# EasyEDA Pro project Ruri-Passport-RevA.epro

# Schematic Mainboard

## Sheets
1 Audio_Storage: Assembly Variant: Basic; Board Name: Board1; Create Date: 2026-09-26; Page Name: Audio_Storage; Project Name: Ruri-Passport-RevA; Schematic Name: Mainboard; Update Date: 2026-09-26; Company: 嘉立创EDA; Page Size: Custom; Version: V1.0
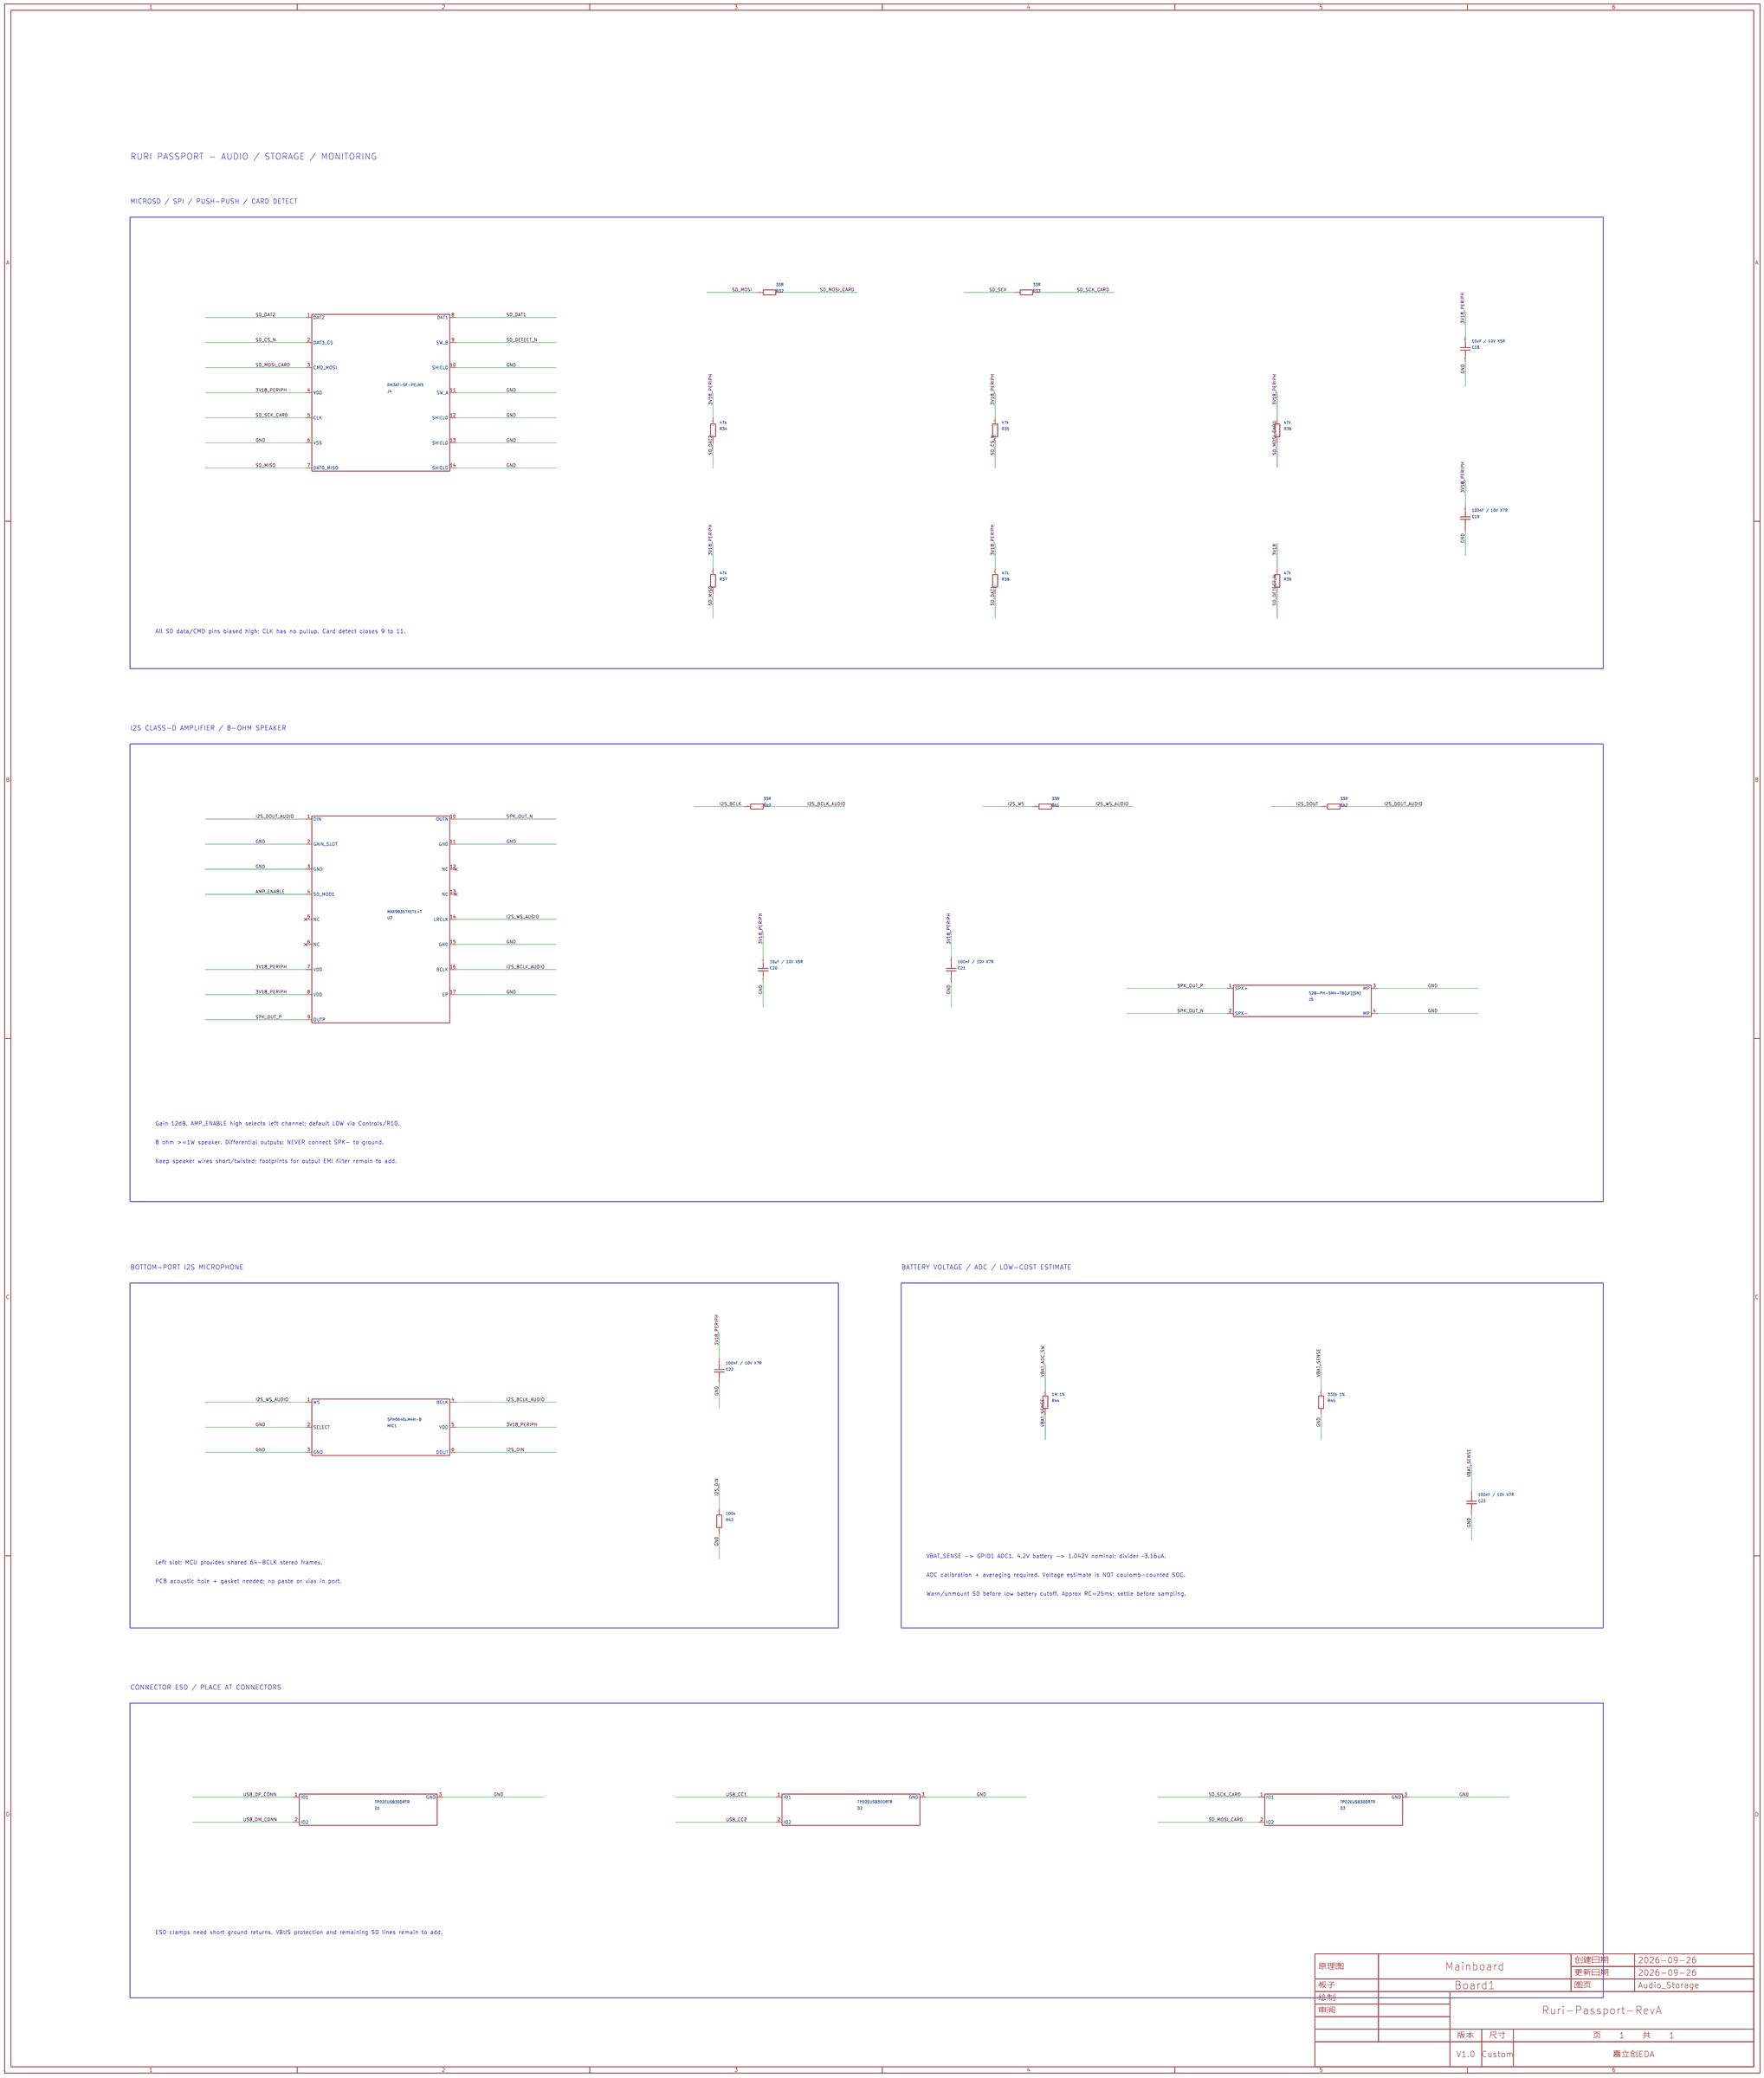
[diagram p0: Audio_Storage]
2 Core
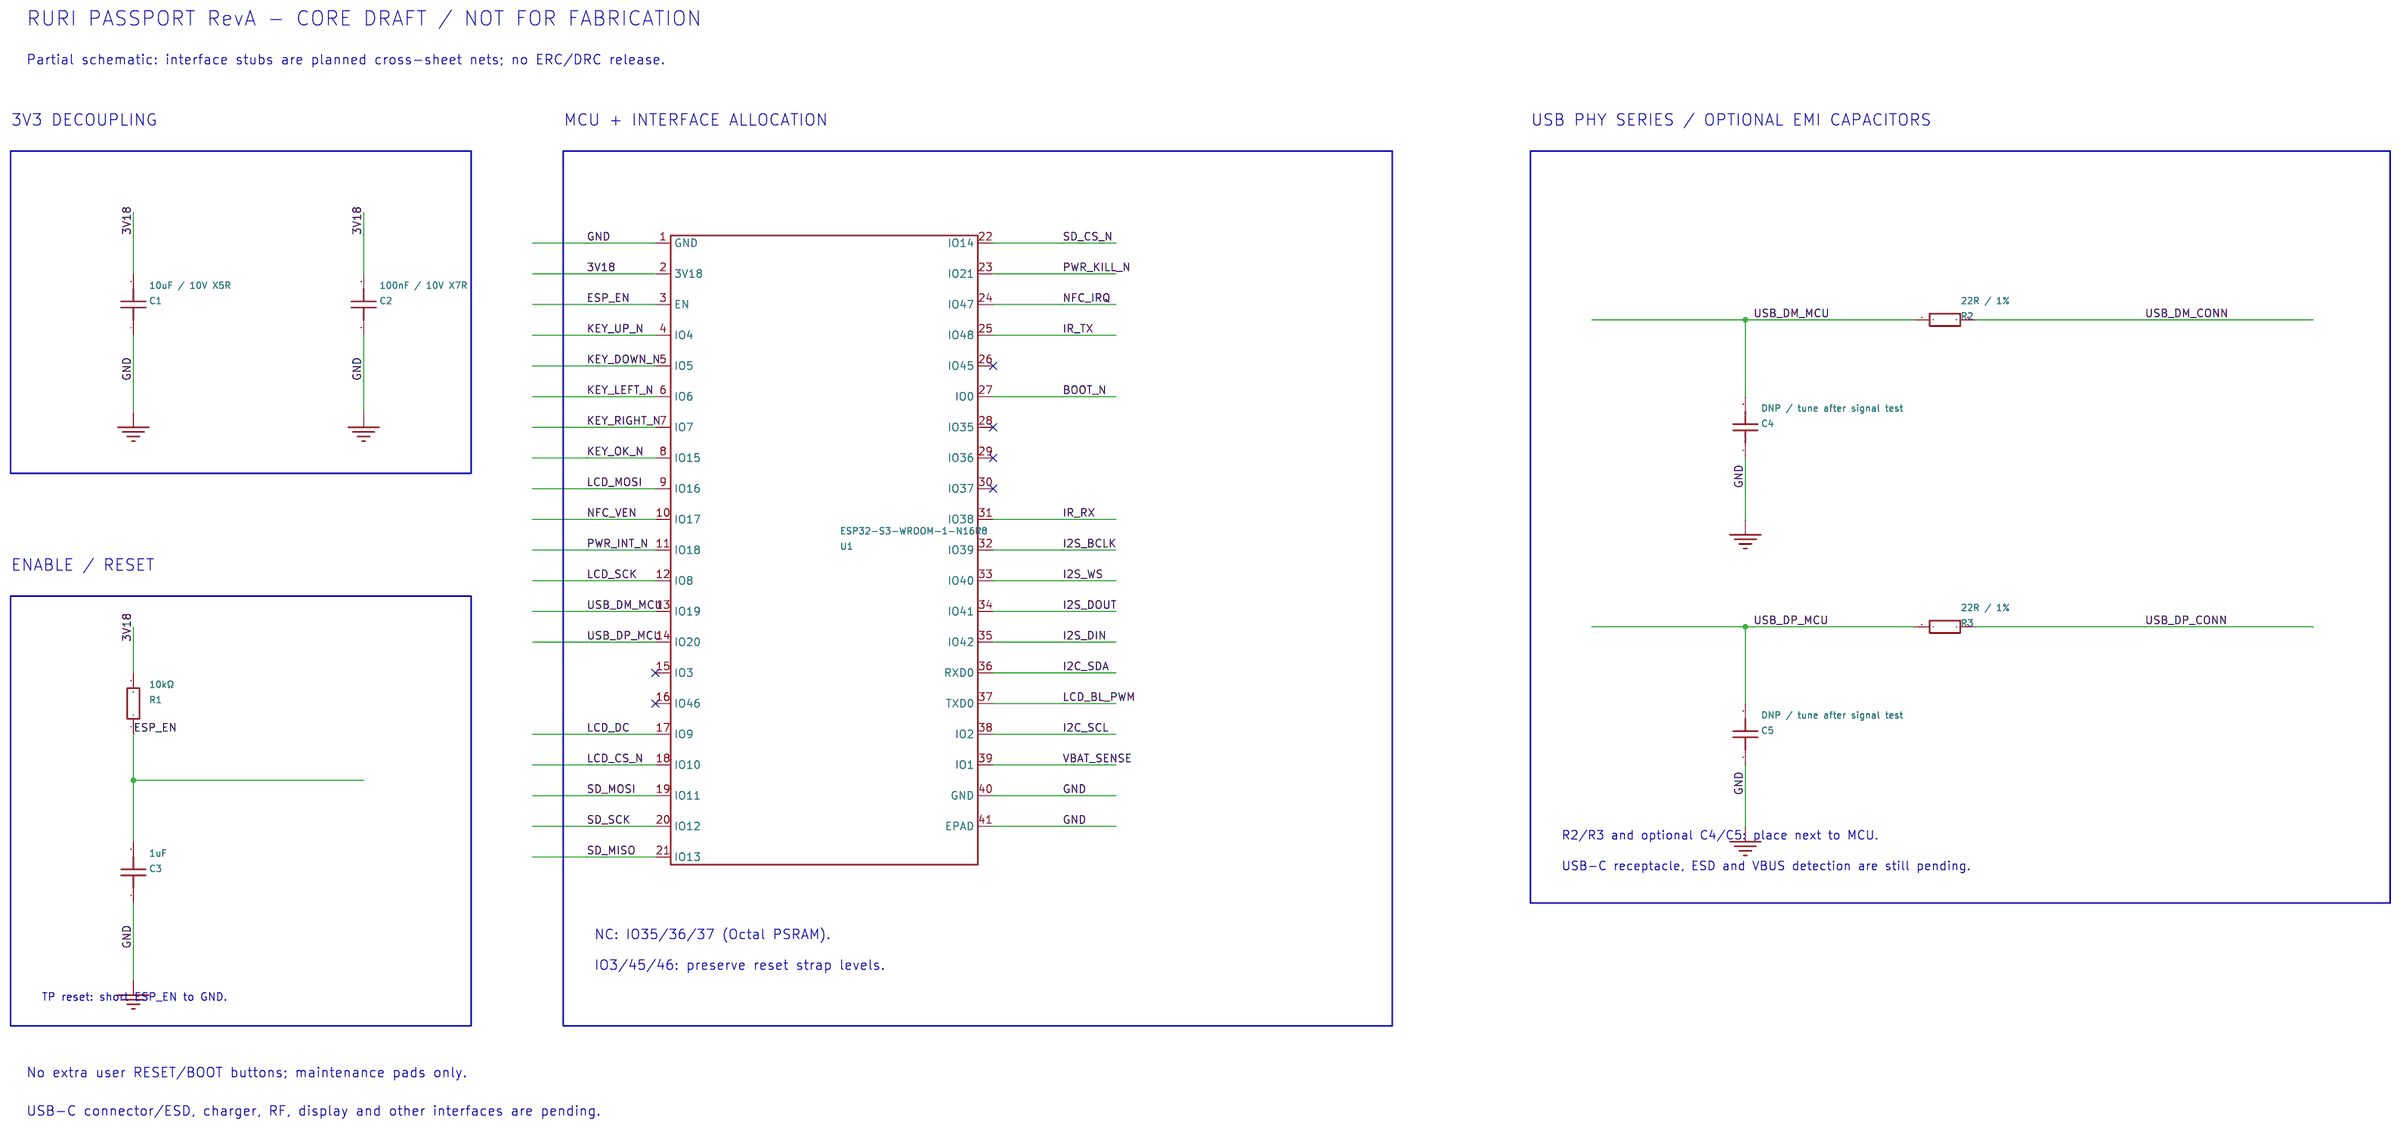
[diagram p1: Core]
3 Display: Page Name: Display
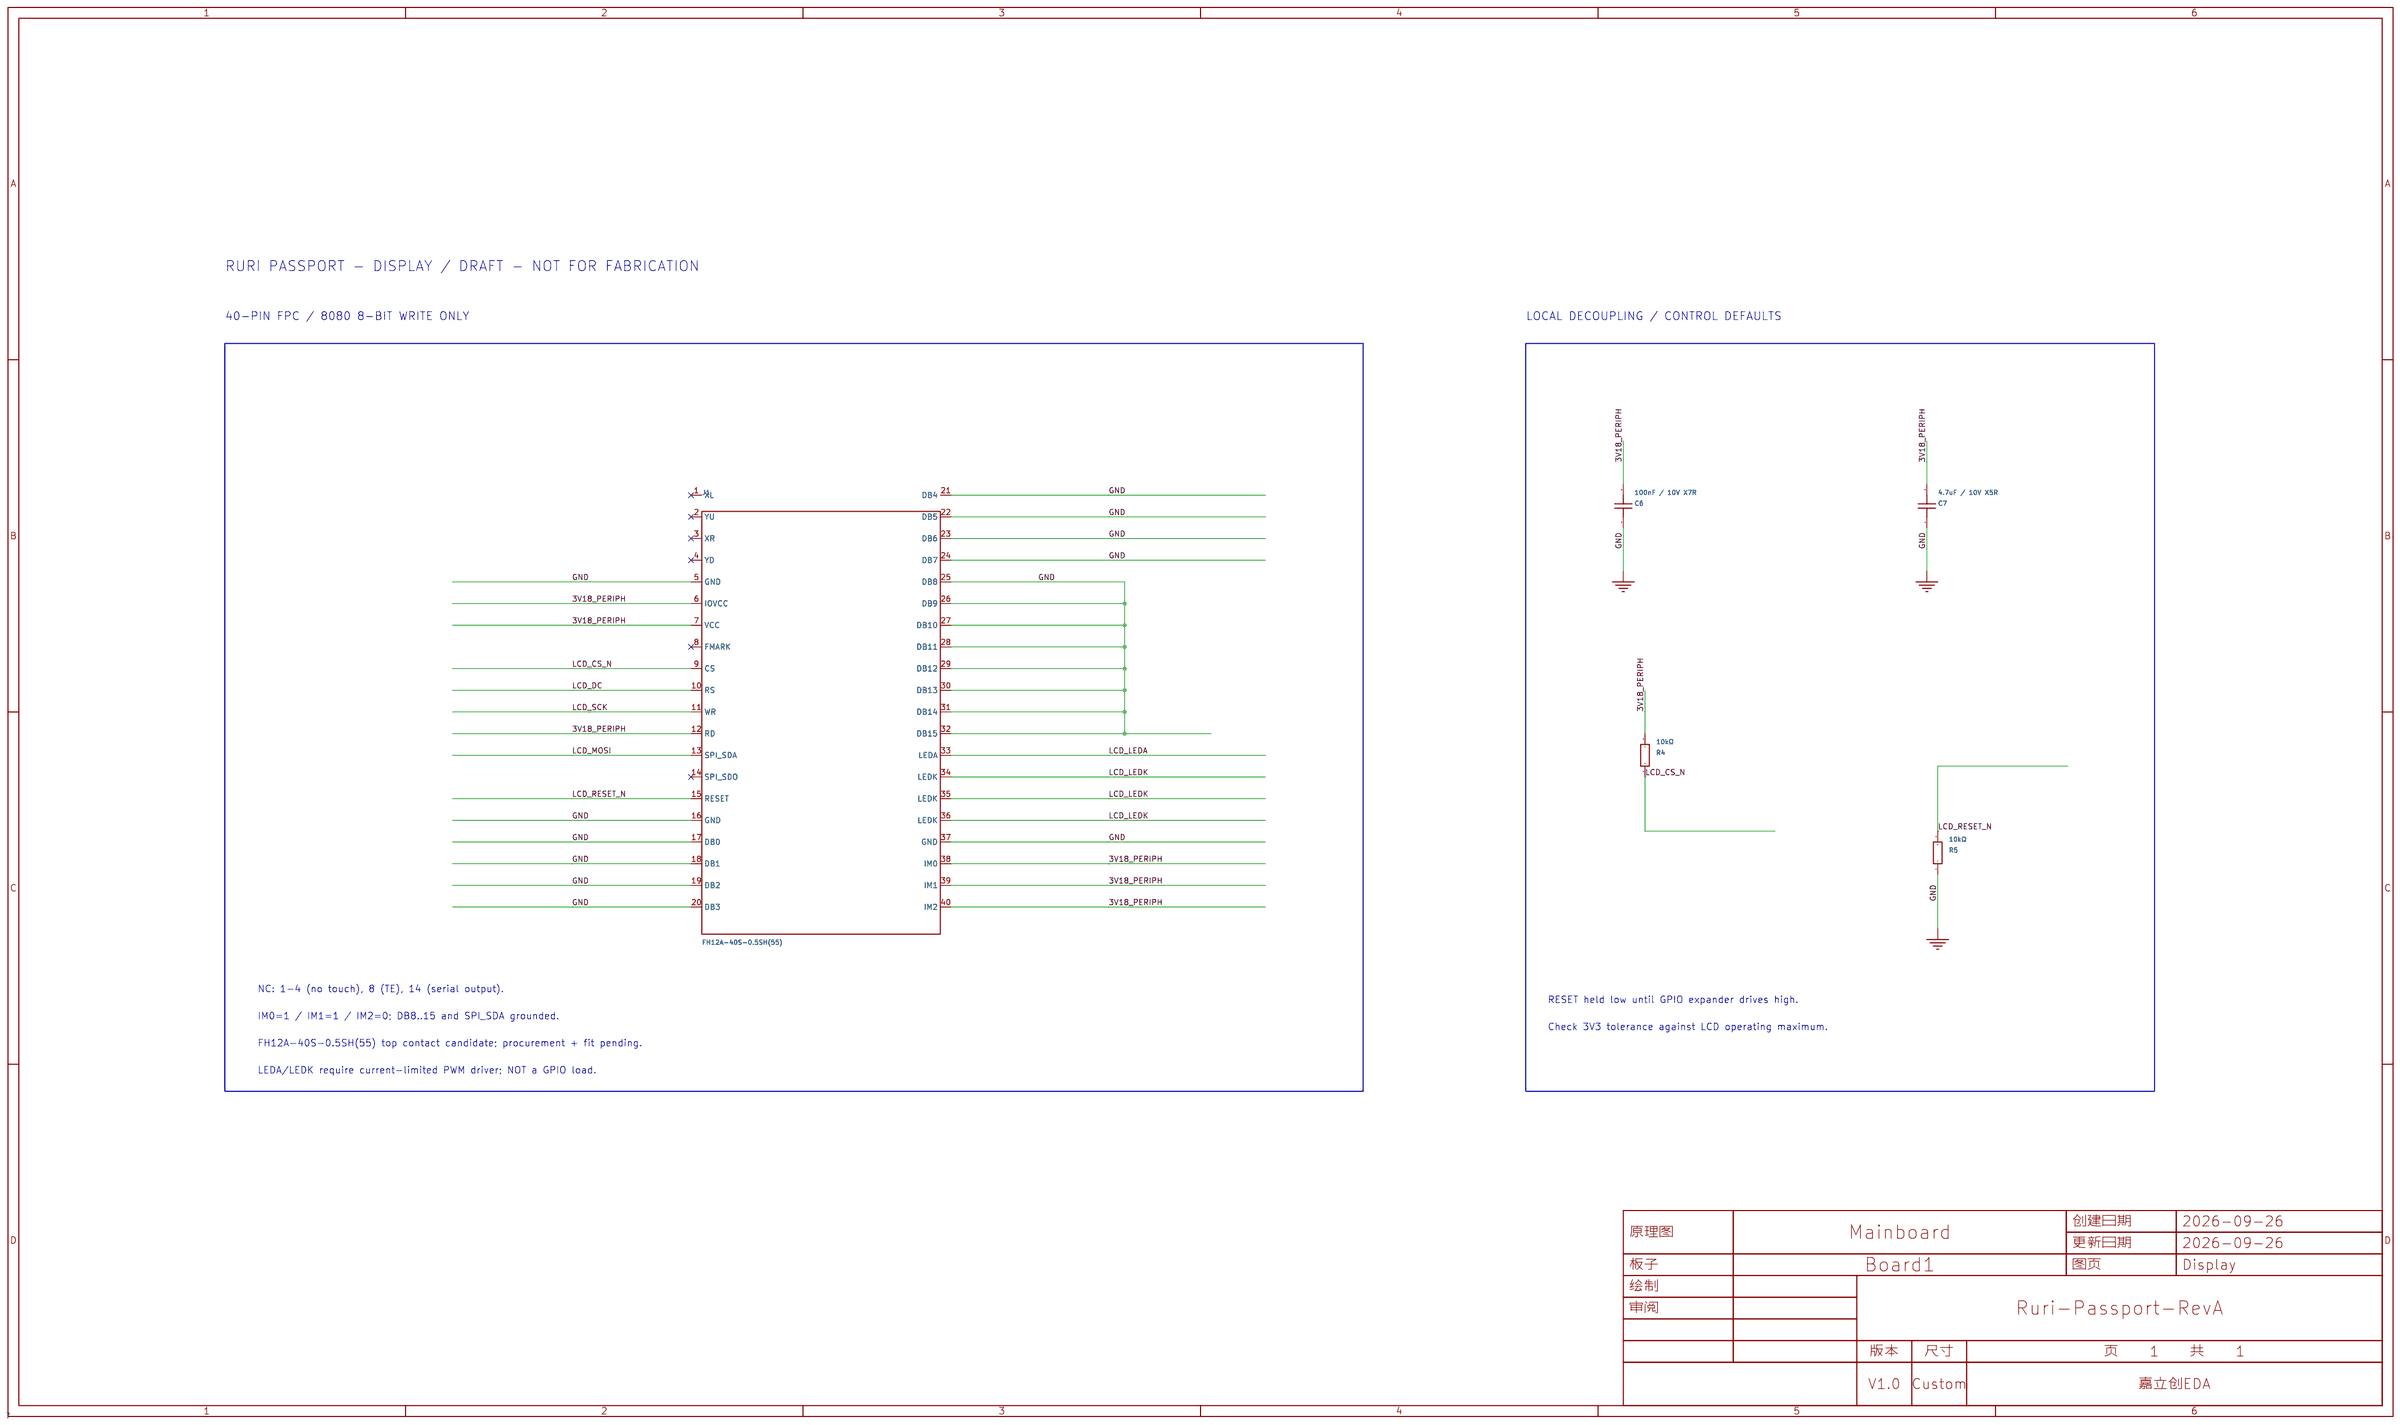
[diagram p2: Display]
4 Controls: Create Date: 2026-09-27; Page Name: Controls; Update Date: 2026-09-27
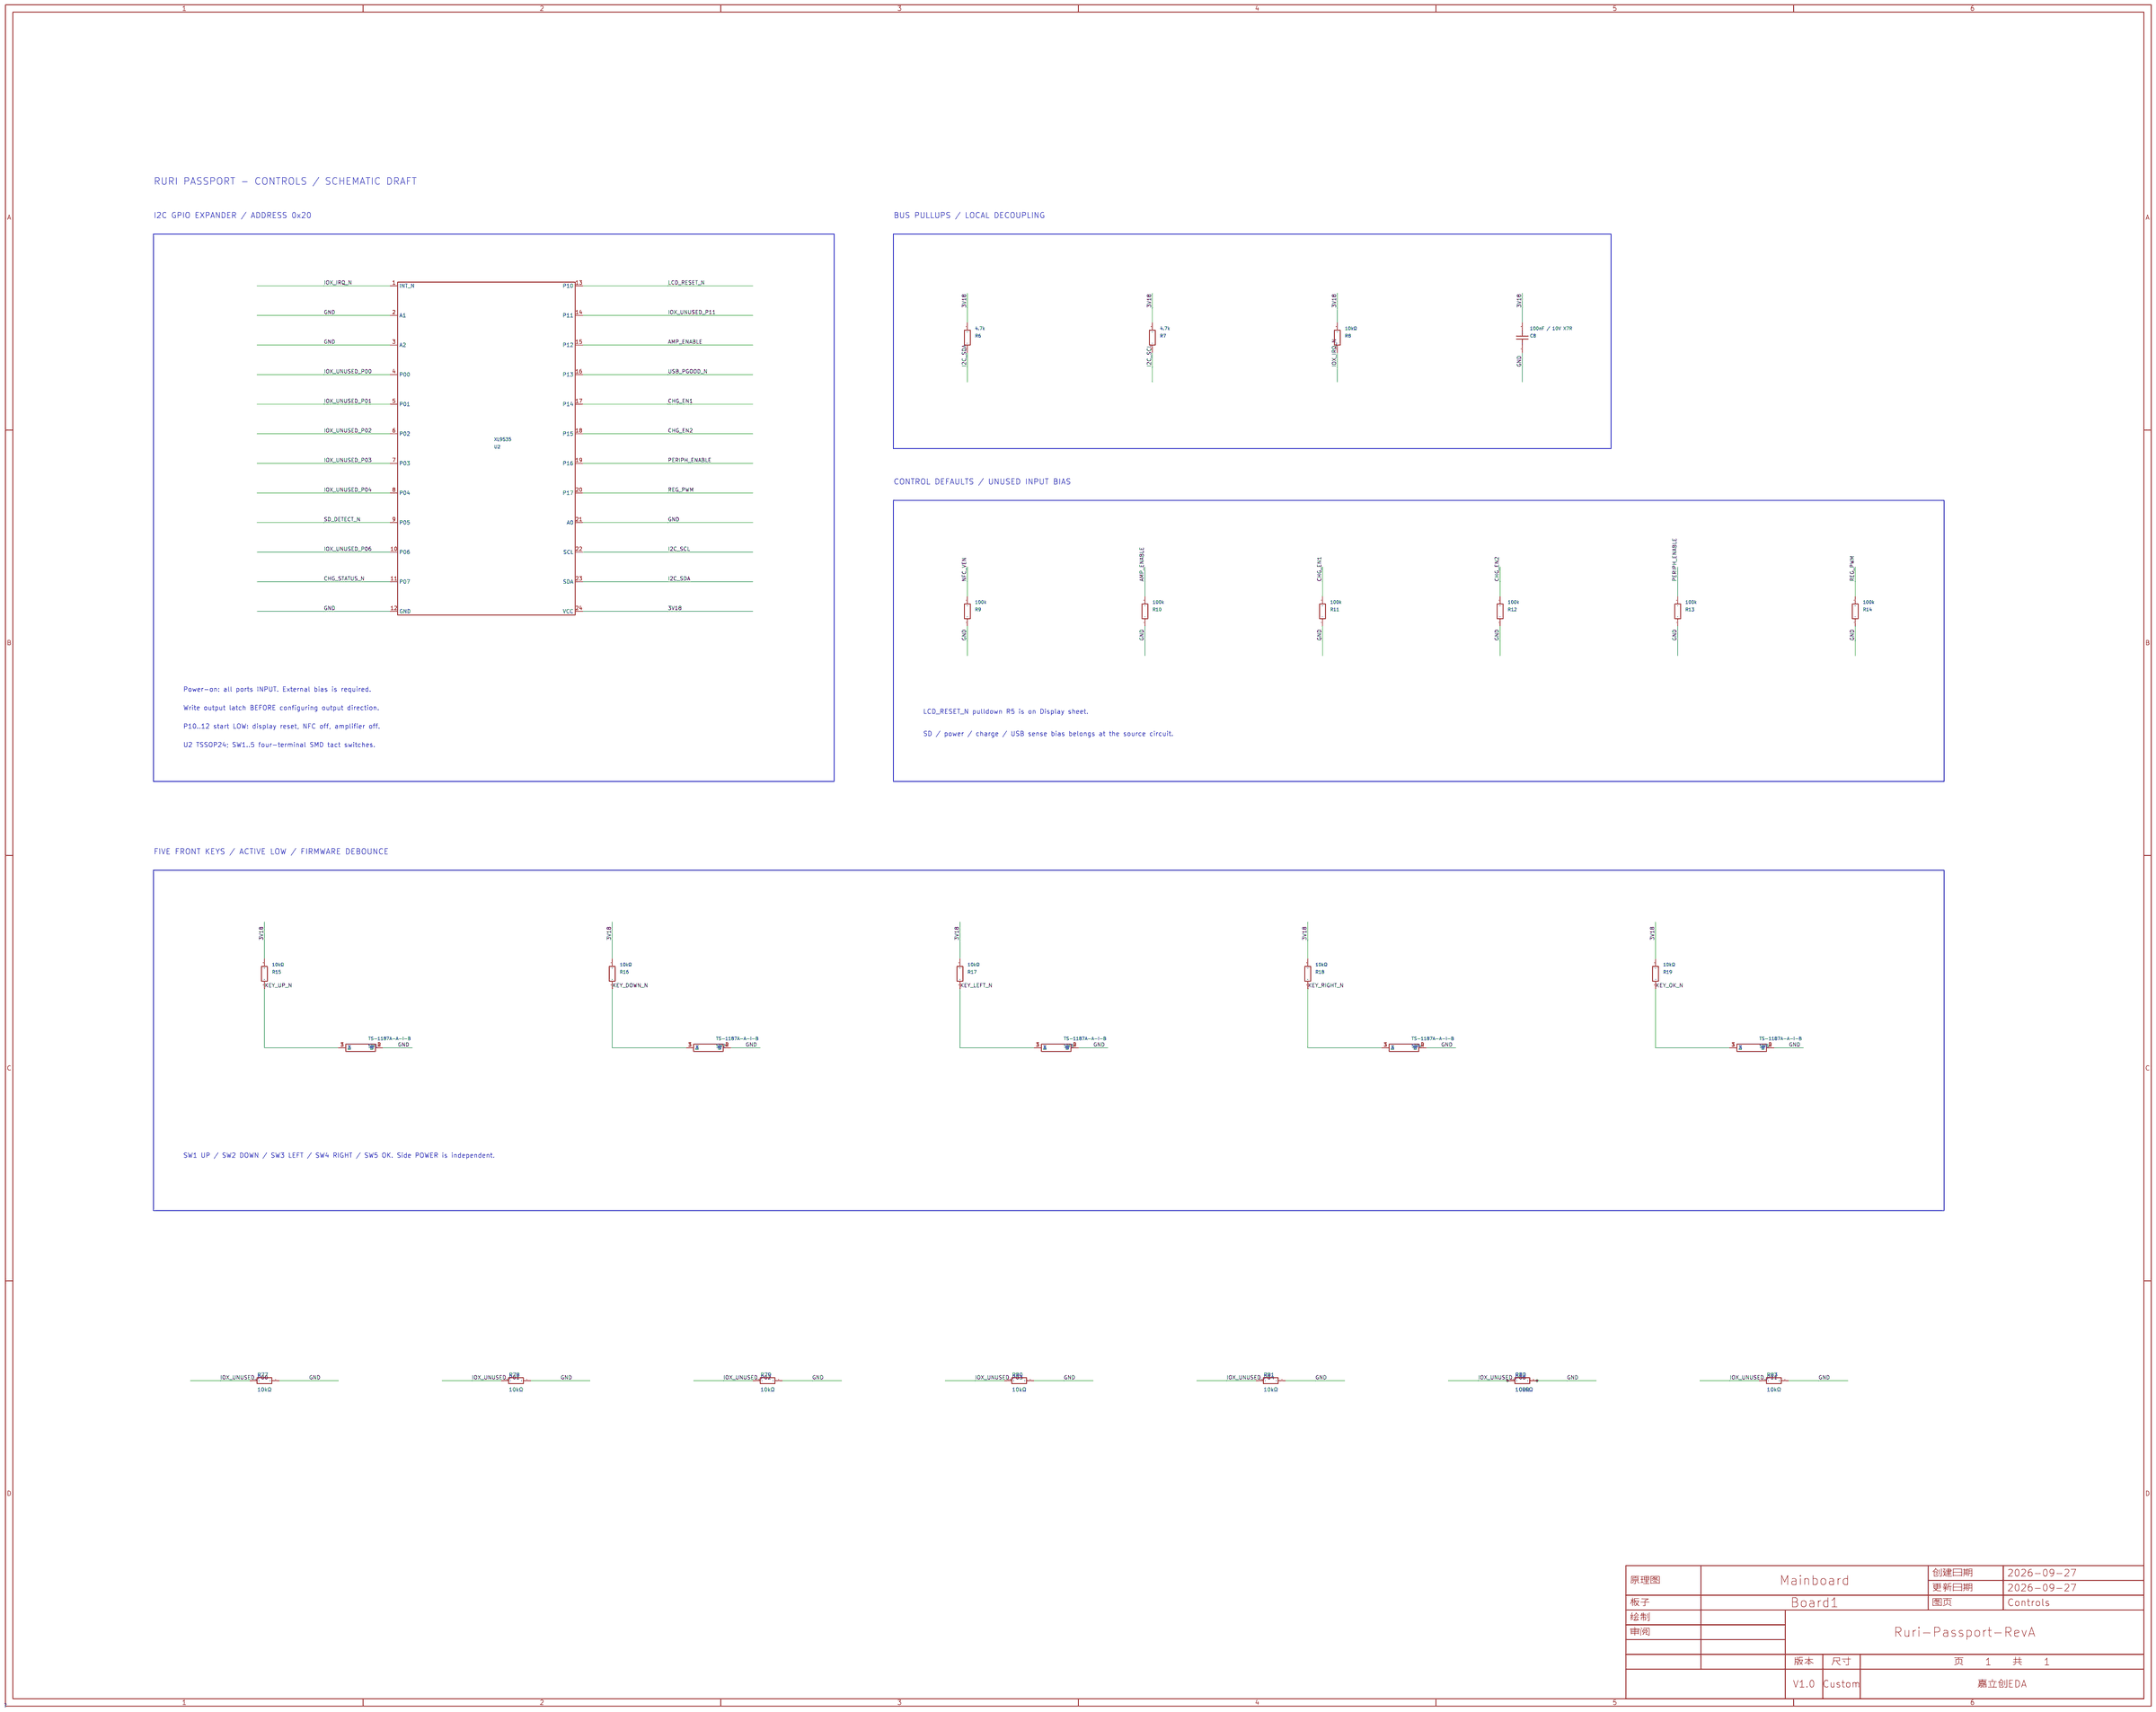
[diagram p3: Controls]
5 Power: Page Name: Power
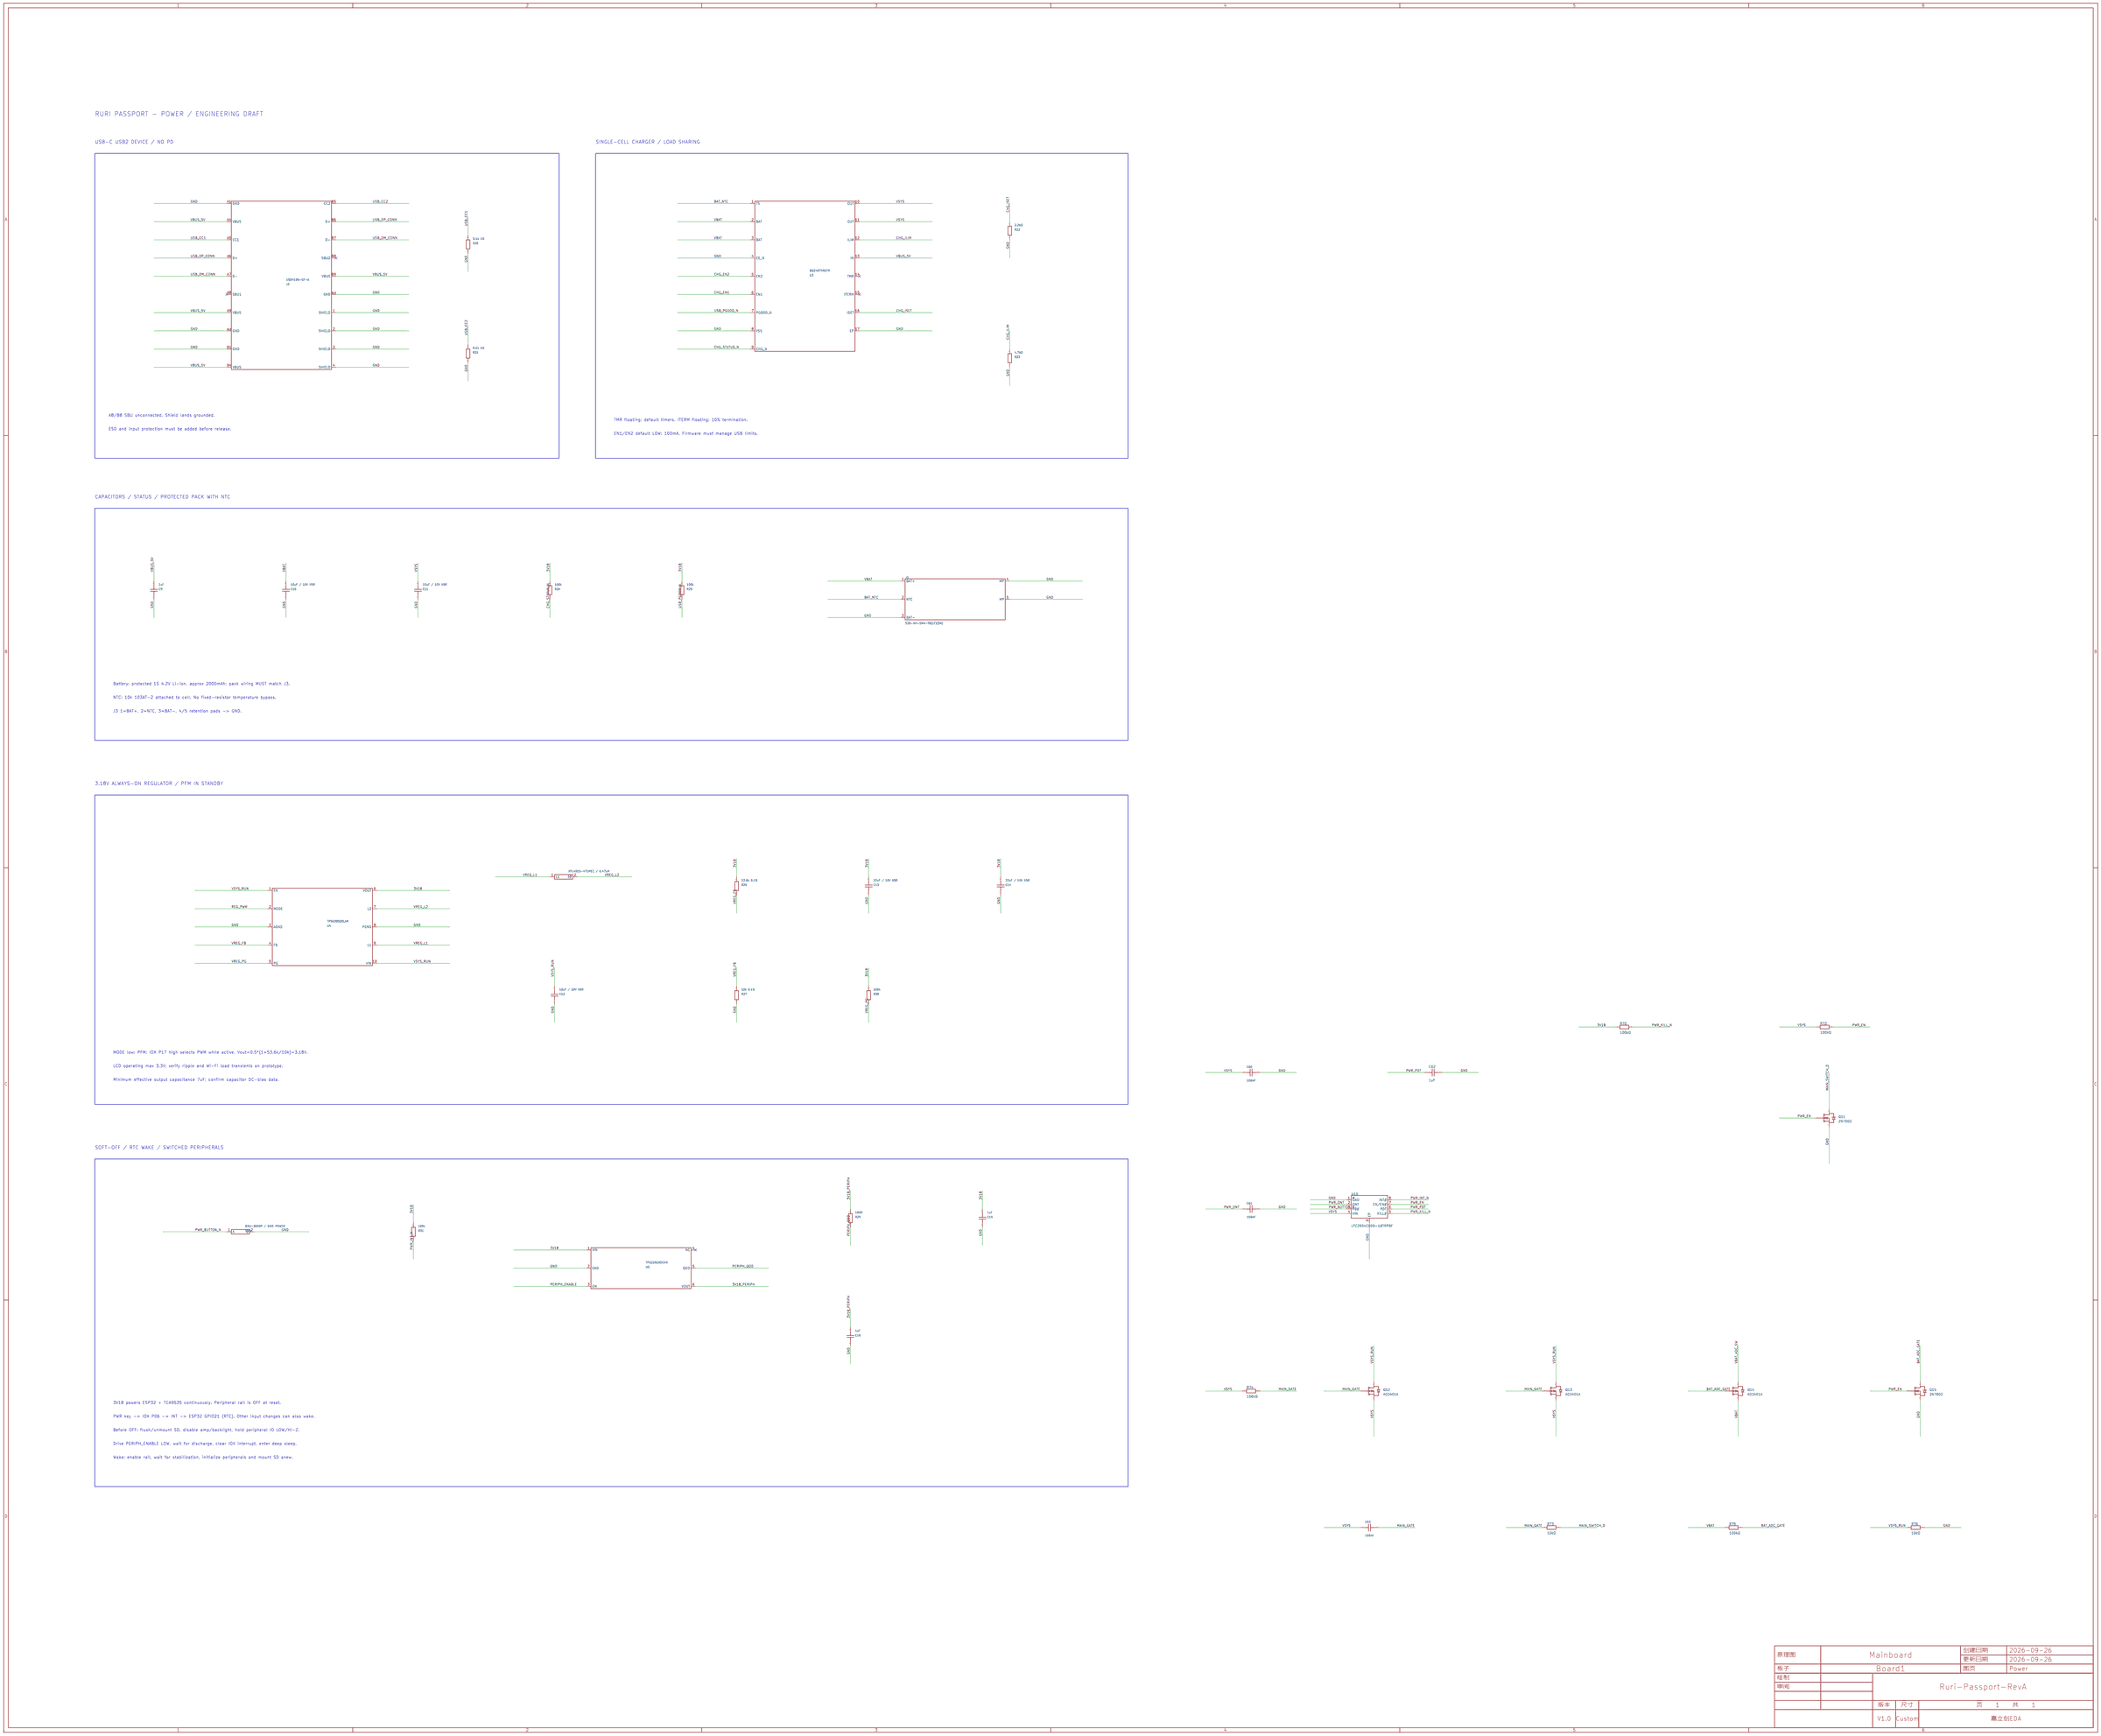
[diagram p4: Power]
6 NFC: Page Name: NFC
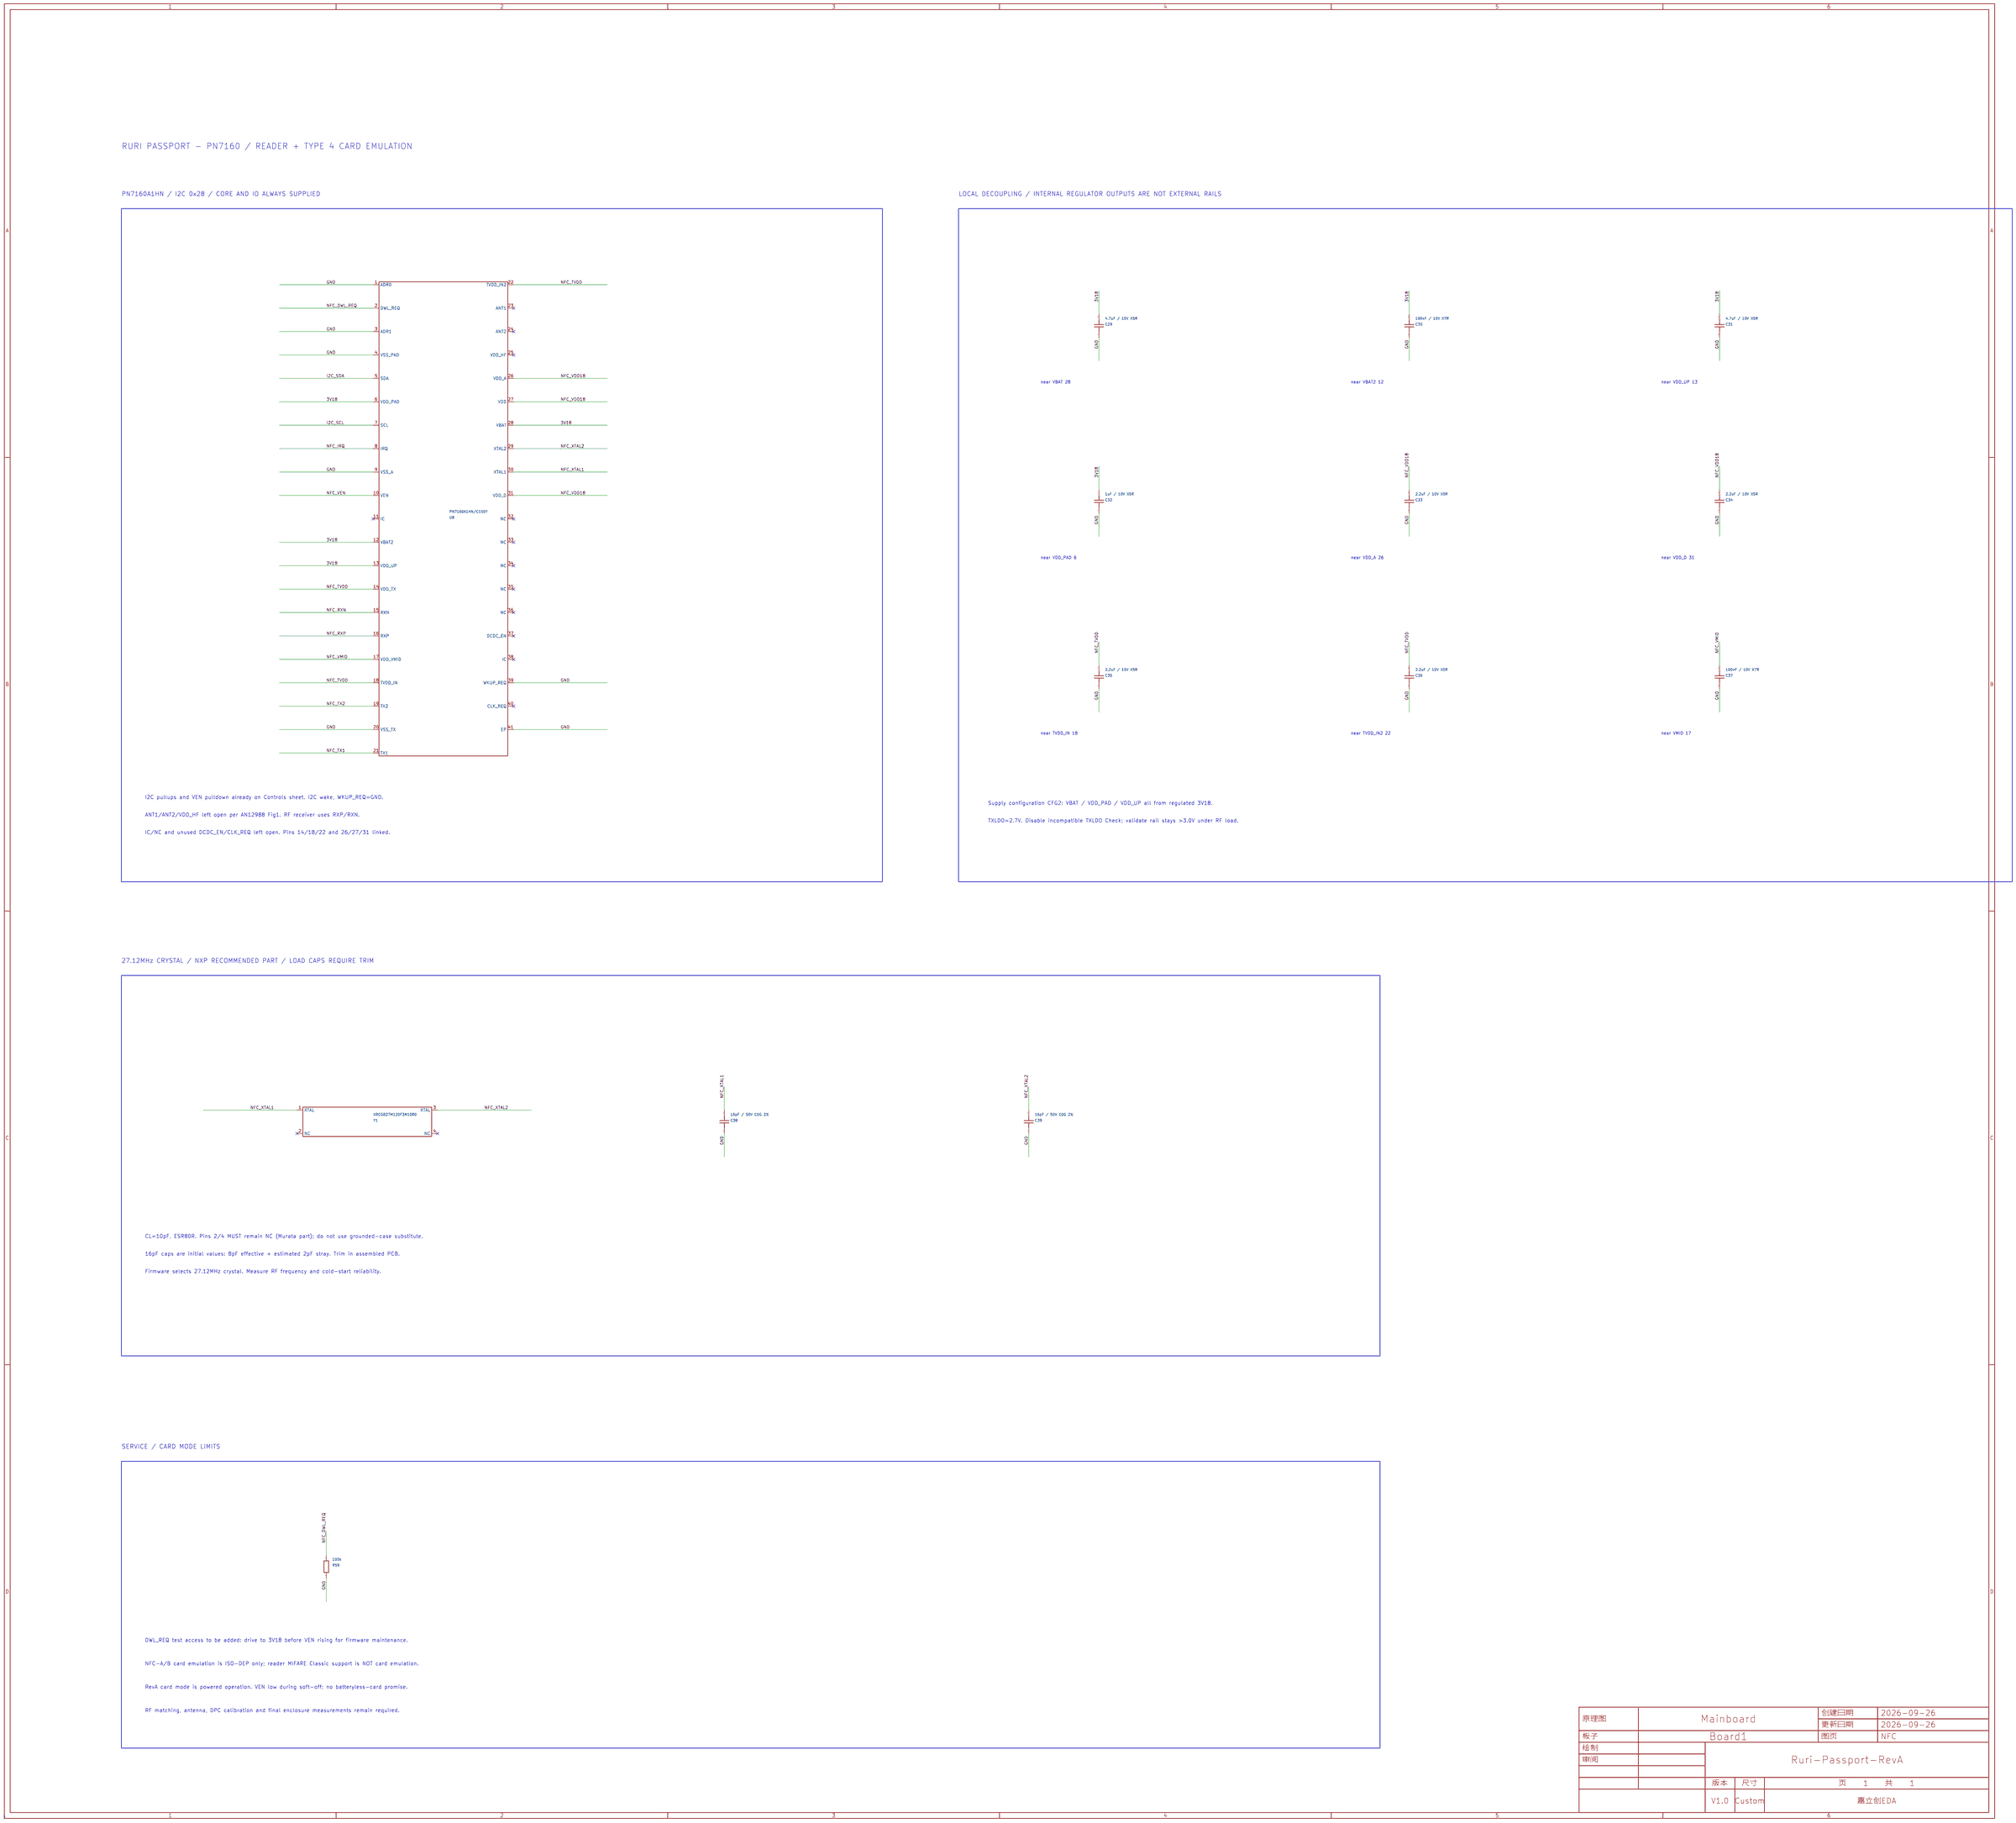
[diagram p5: NFC]
7 Optics: Page Name: Optics
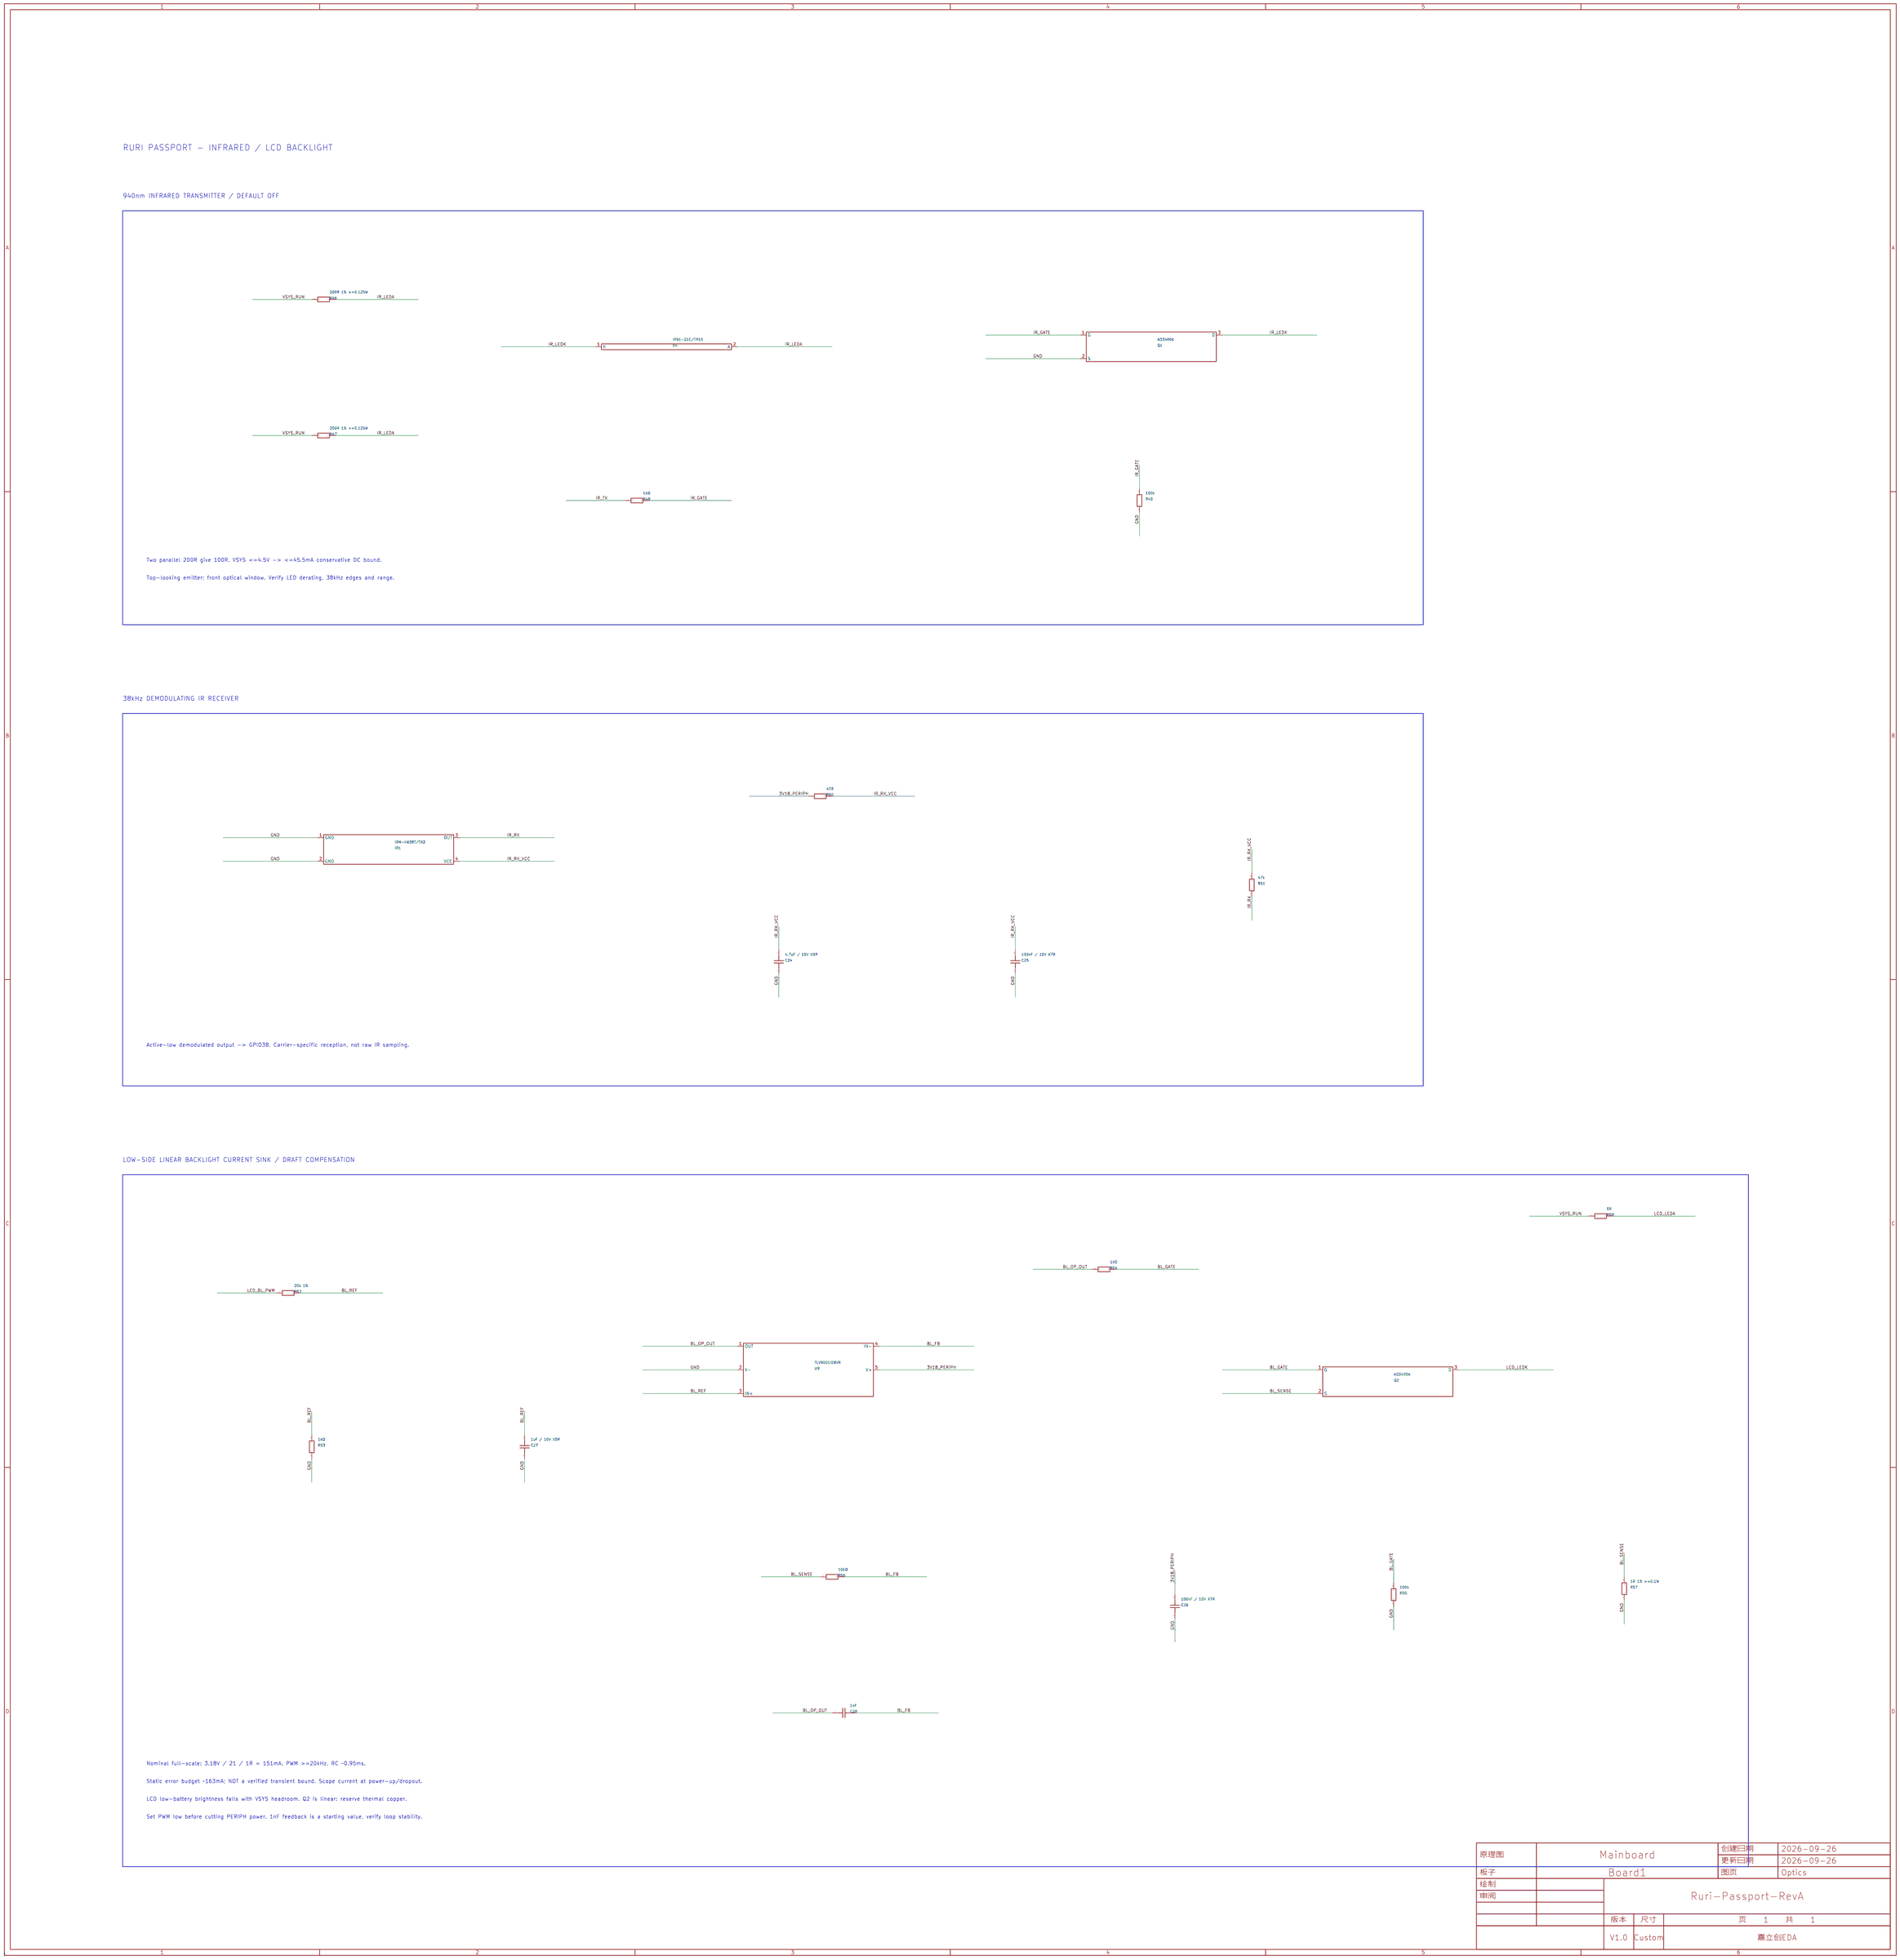
[diagram p6: Optics]
8 RF_Service
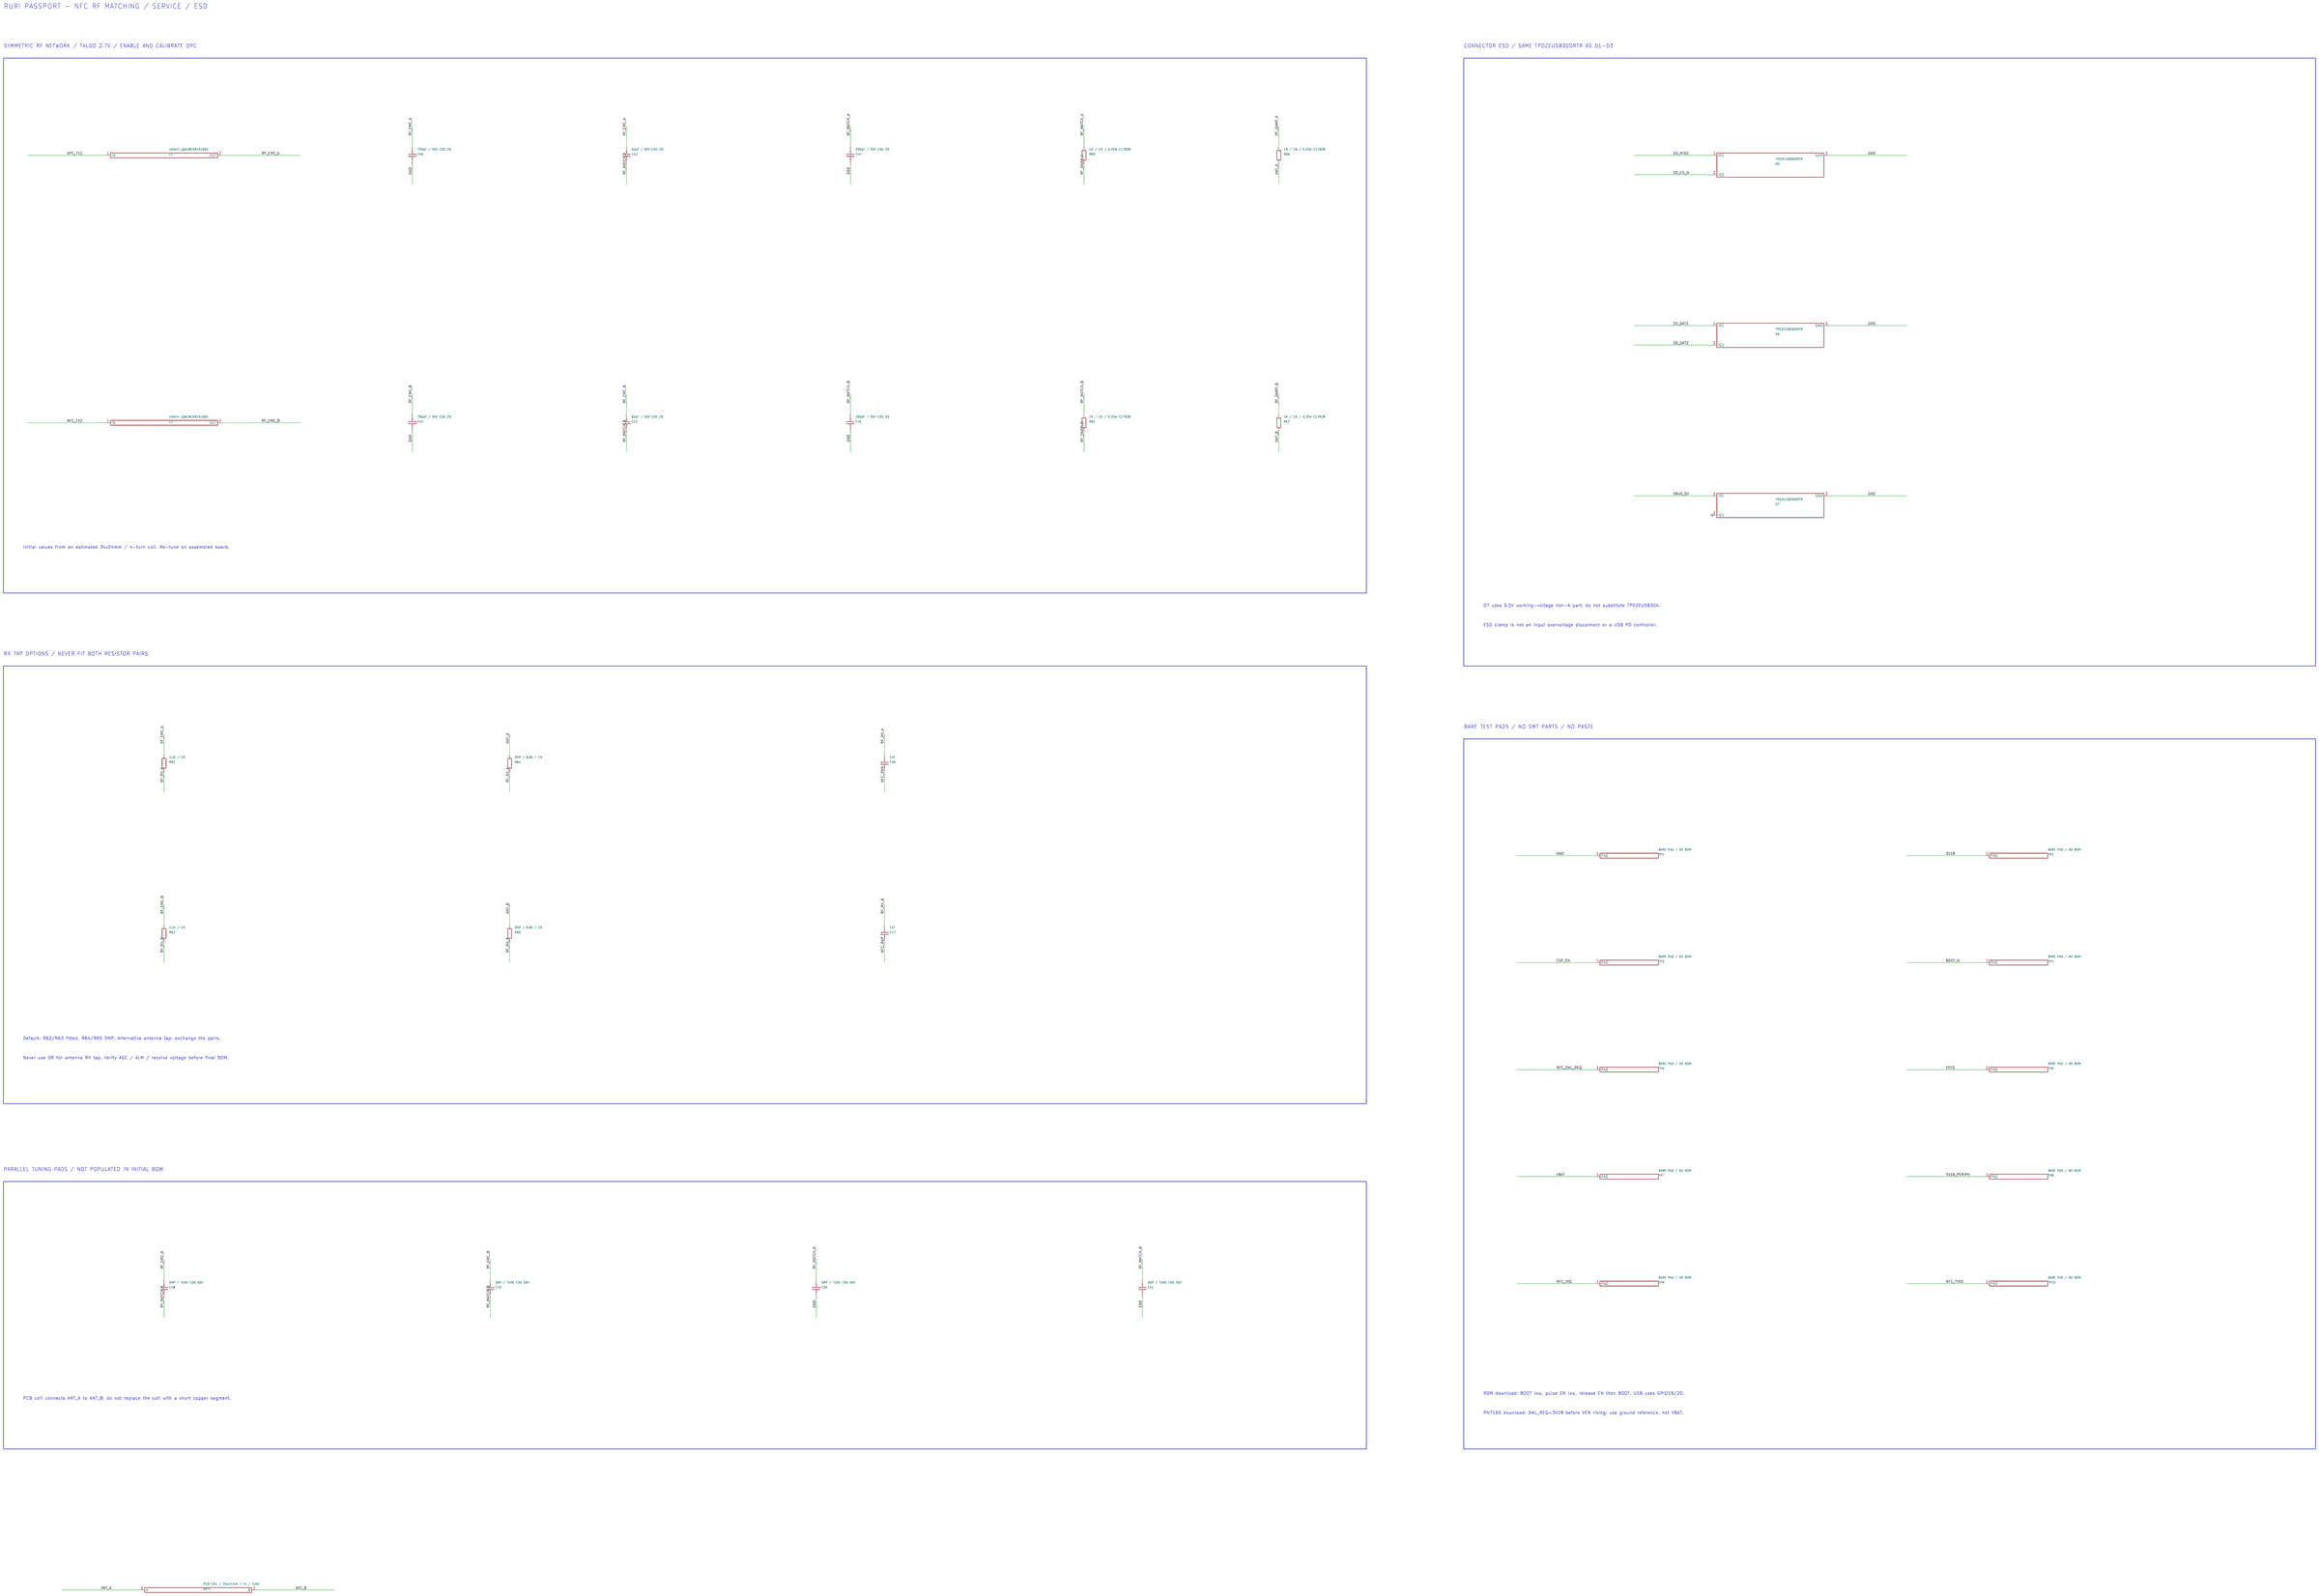
[diagram p7: RF_Service]

## Parts
sheet Audio_Storage
C18  10uF / 10V X5R  [C0603]
C19  100nF / 10V X7R  [C0603]
C20  10uF / 10V X5R  [C0603]
C21  100nF / 10V X7R  [C0603]
C22  100nF / 10V X7R  [C0603]
C23  100nF / 10V X7R  [C0603]
D1  TPD2EUSB30DRTR  [SOT-9X3-3_L1.0-W0.8-P0.35-LS1.0-BR]
D2  TPD2EUSB30DRTR  [SOT-9X3-3_L1.0-W0.8-P0.35-LS1.0-BR]
D3  TPD2EUSB30DRTR  [SOT-9X3-3_L1.0-W0.8-P0.35-LS1.0-BR]
J4  DM3AT-SF-PEJM5  [SD-SMD_DM3AT-SF-PEJM5]
J5  S2B-PH-SM4-TB(LF)(SN)  [CONN-SMD_P2.00_S2B-PH-SM4-TB-LF-SN]
MIC1  SPH0645LM4H-B  [MIC-SMD_6P-L3.5-W2.7-P0.90-BL]
R32  33R  [R0603]
R33  33R  [R0603]
R34  47k  [R0603]
R35  47k  [R0603]
R36  47k  [R0603]
R37  47k  [R0603]
R38  47k  [R0603]
R39  47k  [R0603]
R40  33R  [R0603]
R41  33R  [R0603]
R42  33R  [R0603]
R43  100k  [R0603]
R44  1M 1%  [R0603]
R45  330k 1%  [R0603]
U7  MAX98357AETE+T  [TQFN-16_L3.0-W3.0-P0.50-BL-EP1.5]
sheet Controls
C8  100nF / 10V X7R  [C0603]
R6  4.7k  [R0603]
R7  4.7k  [R0603]
R8  10kΩ  [R0603]
R9  100k  [R0603]
R10  100k  [R0603]
R11  100k  [R0603]
R12  100k  [R0603]
R13  100k  [R0603]
R14  100k  [R0603]
R15  10kΩ  [R0603]
R16  10kΩ  [R0603]
R17  10kΩ  [R0603]
R18  10kΩ  [R0603]
R19  10kΩ  [R0603]
R30  100kΩ  [R0603]
R77  10kΩ  [R0603]
R78  10kΩ  [R0603]
R79  10kΩ  [R0603]
R80  10kΩ  [R0603]
R81  10kΩ  [R0603]
R82  10kΩ  [R0603]
R83  10kΩ  [R0603]
SW1  TS-1187A-A-I-B  [SW-SMD_4P-L5.1-W5.1-P3.70-LS6.5-TL_H1.7]
SW2  TS-1187A-A-I-B  [SW-SMD_4P-L5.1-W5.1-P3.70-LS6.5-TL_H1.7]
SW3  TS-1187A-A-I-B  [SW-SMD_4P-L5.1-W5.1-P3.70-LS6.5-TL_H1.7]
SW4  TS-1187A-A-I-B  [SW-SMD_4P-L5.1-W5.1-P3.70-LS6.5-TL_H1.7]
SW5  TS-1187A-A-I-B  [SW-SMD_4P-L5.1-W5.1-P3.70-LS6.5-TL_H1.7]
U2  XL9535  [TSSOP-24_L7.8-W4.4-P0.65-LS6.4-BL]
sheet Core
C1  10uF / 10V X5R  [C0603]
C2  100nF / 10V X7R  [C0603]
C3  1uF  [C0603]
C4  DNP / tune after signal test  [C0603]  (no BOM)
C5  DNP / tune after signal test  [C0603]  (no BOM)
R1  10kΩ  [R0603]
R2  22R / 1%  [R0603]
R3  22R / 1%  [R0603]
U1  2.4GHz  [WIRELM-SMD_ESP32-S3-WROOM-1]
sheet Display
C6  100nF / 10V X7R  [C0603]
C7  4.7uF / 10V X5R  [C0603]
J1  FH12A-40S-0.5SH(55)  [RURI_FH12A40_TOP_DRAFT]
R4  10kΩ  [R0603]
R5  10kΩ  [R0603]
sheet NFC
C29  4.7uF / 10V X5R  [C0603]
C30  100nF / 10V X7R  [C0603]
C31  4.7uF / 10V X5R  [C0603]
C32  1uF / 10V X5R  [C0603]
C33  2.2uF / 10V X5R  [C0603]
C34  2.2uF / 10V X5R  [C0603]
C35  2.2uF / 10V X5R  [C0603]
C36  2.2uF / 10V X5R  [C0603]
C37  100nF / 10V X7R  [C0603]
C38  16pF / 50V C0G 2%  [C0603]
C39  16pF / 50V C0G 2%  [C0603]
R59  100k  [R0603]
U8  PN7160A1HN/C100Y  [HVQFN-40_L6.0-W6.0-P0.50-BL-EP4.1]
Y1  XRCGB27M120F3M10R0  [CRYSTAL-SMD_4P-L2.0-W1.6-BL]
sheet Optics
C24  4.7uF / 10V X5R  [C0603]
C25  100nF / 10V X7R  [C0603]
C26  100nF / 10V X7R  [C0603]
C27  1uF / 10V X5R  [C0603]
C28  1nF  [C0603]
D4  IR91-21C/TR10  [LED-SMD_IR91-21C-TR10]
IR1  IRM-H638T/TR2  [SENSOR-SMD_IRM-H638T-TR2-TL]
Q1  AO3400A  [SOT-23-3_L2.9-W1.3-P1.90-LS2.4-BR]
Q2  AO3400A  [SOT-23-3_L2.9-W1.3-P1.90-LS2.4-BR]
R46  200R 1% >=0.125W  [R0603]
R47  200R 1% >=0.125W  [R0603]
R48  1kΩ  [R0603]
R49  100k  [R0603]
R50  47R  [R0603]
R51  47k  [R0603]
R52  20k 1%  [R0603]
R53  1kΩ  [R0603]
R54  1kΩ  [R0603]
R55  100k  [R0603]
R56  10kΩ  [R0603]
R57  1R 1% >=0.1W  [R0603]
R58  0R  [R0603]
U9  TLV9001IDBVR  [SOT-23-5_L3.0-W1.7-P0.95-LS2.8-BR]
sheet Power
C9  1uF  [C0603]
C10  10uF / 10V X5R  [C0603]
C11  10uF / 10V X5R  [C0603]
C12  10uF / 10V X5R  [C0603]
C13  22uF / 10V X5R  [C0603]
C14  22uF / 10V X5R  [C0603]
C15  1uF  [C0603]
C16  1uF  [C0603]
C60  100nF  [C0603]
C61  100nF  [C0603]
C62  1uF  [C0603]
C63  100nF  [C0603]
J2  USB4105-GF-A  [RURI_GCT_USB4105_REVB1]
J3  S3B-XH-SM4-TB(LF)(SN)  [CONN-SMD_B3B-PH-SM4-TB-LF-SN]
L1  XFL4015-471MEC / 0.47uH  [IND-SMD_L4.0-W4.0_XFL4020-102MEB]
Q11  2N7002  [SOT-23-3_L2.9-W1.3-P1.90-LS2.4-BR]
Q12  AO3401A  [SOT-23_L2.9-W1.3-P1.90-LS2.4-BR]
Q13  AO3401A  [SOT-23_L2.9-W1.3-P1.90-LS2.4-BR]
Q14  AO3401A  [SOT-23_L2.9-W1.3-P1.90-LS2.4-BR]
Q15  2N7002  [SOT-23-3_L2.9-W1.3-P1.90-LS2.4-BR]
R20  5.1k 1%  [R0603]
R21  5.1k 1%  [R0603]
R22  2.2kΩ  [R0603]
R23  4.7kΩ  [R0603]
R24  100k  [R0603]
R25  100k  [R0603]
R26  53.6k 0.1%  [R0603]
R27  10k 0.1%  [R0603]
R28  100k  [R0603]
R29  100R  [R0603]
R31  100k  [R0603]
R70  100kΩ  [R0603]
R72  100kΩ  [R0603]
R73  10kΩ  [R0603]
R74  100kΩ  [R0603]
R75  100kΩ  [R0603]
R76  100kΩ  [R0603]
SW6  B3U-3000P / SIDE POWER  [KEY-SMD_B3U-3000P]
U3  BQ24074RGTR  [QFN-16_L3.0-W3.0-P0.50-TL-EP1.7]
U4  TPS63802DLAR  [VSON-HR-10_L3.0-W2.0-P0.50-TL]
U5  TPS22919DCKR  [SC-70-6_L2.2-W1.3-P0.65-LS2.1-BR]
U10  LTC2954CDDB-1#TRPBF  [DFN-8_L3.0-W2.0-P0.50-LS2.6-BL-EP]
sheet RF_Service
ANT1  PCB COIL / 34x24mm / 4T / TUNE  [RURI_NFC_COIL_34X24]  (no BOM)
C40  750pF / 50V C0G 2%  [C0603]
C41  750pF / 50V C0G 2%  [C0603]
C42  62pF / 50V C0G 2%  [C0603]
C43  62pF / 50V C0G 2%  [C0603]
C44  200pF / 50V C0G 2%  [C0603]
C45  200pF / 50V C0G 2%  [C0603]
C46  1nF  [C0603]
C47  1nF  [C0603]
C48  DNP / TUNE C0G 50V  [C0603]  (no BOM)
C49  DNP / TUNE C0G 50V  [C0603]  (no BOM)
C50  DNP / TUNE C0G 50V  [C0603]  (no BOM)
C51  DNP / TUNE C0G 50V  [C0603]  (no BOM)
D5  TPD2EUSB30DRTR  [SOT-9X3-3_L1.0-W0.8-P0.35-LS1.0-BR]
D6  TPD2EUSB30DRTR  [SOT-9X3-3_L1.0-W0.8-P0.35-LS1.0-BR]
D7  TPD2EUSB30DRTR  [SOT-9X3-3_L1.0-W0.8-P0.35-LS1.0-BR]
L2  160nH LQW18CNR16J00D  [IND-SMD_L1.6-W0.8-1]
L3  160nH LQW18CNR16J00D  [IND-SMD_L1.6-W0.8-1]
R60  1R / 1% / 0.25W C17928  [R1206]
R61  1R / 1% / 0.25W C17928  [R1206]
R62  2.2k / 1%  [R0603]
R63  2.2k / 1%  [R0603]
R64  DNP / 6.8k / 1%  [R0603]  (no BOM)
R65  DNP / 6.8k / 1%  [R0603]  (no BOM)
R66  1R / 1% / 0.25W C17928  [R1206]
R67  1R / 1% / 0.25W C17928  [R1206]
TP1  BARE PAD / NO BOM  [RURI_TP_1MM]  (no BOM)
TP2  BARE PAD / NO BOM  [RURI_TP_1MM]  (no BOM)
TP3  BARE PAD / NO BOM  [RURI_TP_1MM]  (no BOM)
TP4  BARE PAD / NO BOM  [RURI_TP_1MM]  (no BOM)
TP5  BARE PAD / NO BOM  [RURI_TP_1MM]  (no BOM)
TP6  BARE PAD / NO BOM  [RURI_TP_1MM]  (no BOM)
TP7  BARE PAD / NO BOM  [RURI_TP_1MM]  (no BOM)
TP8  BARE PAD / NO BOM  [RURI_TP_1MM]  (no BOM)
TP9  BARE PAD / NO BOM  [RURI_TP_1MM]  (no BOM)
TP10  BARE PAD / NO BOM  [RURI_TP_1MM]  (no BOM)

## Library data of the parts
C1 C10-C12 C18 C20 = 10uF / 10V X5R
C2 C6 C8 C19 C21-C23 C25 C26 C30 C37 = 100nF / 10V X7R
D1-D3 D5-D7 = TPD2EUSB30DRTR
J4 = DM3AT-SF-PEJM5
J5 = S2B-PH-SM4-TB(LF)(SN)
MIC1 = SPH0645LM4H-B
R32 R33 R40-R42 = 33R
R34-R39 R51 = 47k
R9-R14 R24 R25 R28 R31 R43 R49 R55 R59 = 100k
R44 = 1M 1%
R45 = 330k 1%
U7 = MAX98357AETE+T
R6 R7 = 4.7k
R1 R4 R5 R8 R15-R19 R56 = 0603WAF1002T5E: Supplier Part: C25804; Manufacturer: UNI-ROYAL(厚声); Supplier: LCSC; LCSC Part Name: 厚膜电阻 10kΩ ±1% 100mW; Supplier Footprint: 0603; JLCPCB Part Class: Basic Part; Datasheet: https://item.szlcsc.com/datasheet/0603WAF1002T5E/26547.html; Type: 厚膜电阻; Tolerance: ±1%; Power(Watts): 100mW; Voltage-Supply(Max): 75V; Temperature Coefficient: ±100ppm/℃; Operating Temperature: -55℃~+155℃
R30 R70 R72 R74 R75 = 0603WAF1003T5E: 电阻类型:厚膜电阻;阻值:100kΩ;精度:±1%;功率:100mW;工作电压:75V;温度系数:±100ppm/℃;; LCSC Part Name: 厚膜电阻 100kΩ ±1%; Supplier Part: C25803; Manufacturer: UNI-ROYAL(厚声); Supplier Footprint: 0603; JLCPCB Part Class: Basic Part; Datasheet: https://item.szlcsc.com/datasheet/0603WAF1003T5E/26546.html; Supplier: LCSC; Type: 厚膜电阻; Tolerance: ±1%; Power(Watts): 100mW; Voltage-Supply(Max): 75V; Temperature Coefficient: ±100ppm/℃; Operating Temperature: -55℃~+155℃
R73 R76-R83 = 0603WAF1002T5E: 电阻类型:厚膜电阻;阻值:10kΩ;精度:±1%;功率:100mW;工作电压:75V;温度系数:±100ppm/℃;; LCSC Part Name: 厚膜电阻 10kΩ ±1% 100mW; Supplier Part: C25804; Manufacturer: UNI-ROYAL(厚声); Supplier Footprint: 0603; JLCPCB Part Class: Basic Part; Datasheet: https://item.szlcsc.com/datasheet/0603WAF1002T5E/26547.html; Supplier: LCSC; Type: 厚膜电阻; Tolerance: ±1%; Power(Watts): 100mW; Voltage-Supply(Max): 75V; Temperature Coefficient: ±100ppm/℃; Operating Temperature: -55℃~+155℃
SW1-SW5 = TS-1187A-A-I-B: Supplier Part: C21262538; Manufacturer: XKB Connection(中国星坤); Supplier: LCSC; Supplier Footprint: SMD-4P,5.1x5.1mm; JLCPCB Part Class: Extended Part; Datasheet: https://item.szlcsc.com/datasheet/TS-1187A-A-I-B/22681271.html
U2 = XL9535: LCSC Part Name: 16位I²C总线和SMBus I/O端口扩展器，带中断输出和配置寄存器; Supplier Part: C561273; Manufacturer: XINLUDA(信路达); Supplier Footprint: TSSOP-24; JLCPCB Part Class: Extended Part; Datasheet: https://item.szlcsc.com/datasheet/XL9535/586603.html; Supplier: LCSC; Interface: I2C；SMBus; Number of I/O: 16; Interrupt Output: 有中断输出; Output Type: 推挽式; Current - Output Low(IOL): 25mA; Current - Output High(IOH): 10mA; Clock Frequency: 400kHz; Number of Supporting Devices: 8; Quiescent Supply Current: 250nA; Output Logic Level - High: 4V; Features: 复位功能；级联与地址扩展; Voltage - Supply: 2.3V~5.5V; Operating Temperature: -40℃~+85℃
C3 C9 C15 C16 = CL10A105KB8NNNC: Supplier Part: C15849; Manufacturer: SAMSUNG(三星); Supplier: LCSC; LCSC Part Name: 1uF ±10% 50V; Supplier Footprint: 0603; JLCPCB Part Class: Basic Part; Datasheet: https://item.szlcsc.com/datasheet/CL10A105KB8NNNC/16531.html; Tolerance: ±10%; Voltage Rating: 50V; Temperature Coefficient: X5R
C4 C5 = DNP / tune after signal test
R2 R3 = 22R / 1%
U1 = ESP32-S3-WROOM-1-N16R8: LCSC Part Name: 不带固件 通用型Wi-Fi+低功耗蓝牙MCU模组; Supplier Part: C2913202; Manufacturer: ESPRESSIF(乐鑫); Supplier Footprint: SMD,25.5x18mm; JLCPCB Part Class: Extended Part; Datasheet: https://item.szlcsc.com/datasheet/ESP32-S3-WROOM-1-N16R8/3198300.html; Supplier: LCSC; Utilized IC / Part: ESP32-S3R8; Interface Type: I2C；GPIO；UART；SPI；USB；I2S; Antenna Type: 板载PCB天线; Output Power: 20.5dBm; Voltage - Supply: 3V~3.6V; Receive  Current: 95mA; Send  Current: 355mA; Sensitivity: -103.5dBm; Operating Temperature: -40℃~+65℃
C7 C24 C29 C31 = 4.7uF / 10V X5R
J1 = FH12A-40S-0.5SH(55): Supplier Part: C506795; Manufacturer: HRS(广濑); Supplier: LCSC; LCSC Part Name: 间距:0.5mm P数:40P 翻盖式 上接; Supplier Footprint: SMD,P=0.5mm,卧贴; JLCPCB Part Class: Extended Part; Datasheet: https://atta.szlcsc.com/upload/public/pdf/source/20200930/C506794_BAC3F5461F8E9F3247A2F39FD203D182.pdf; Locking Feature: 翻盖式; Contact Type: 上接; Number of Contacts: 40P; Pitch: 0.5mm; Mounting Type: 卧贴; FFC, FCB Thickness: 0.3mm; Height Above Board: 2mm; Contact Material: 磷青铜; Contact Plating: 金; Operating Temperature Range: -40℃~+85℃
C27 C32 = 1uF / 10V X5R
C33-C36 = 2.2uF / 10V X5R
C38 C39 = 16pF / 50V C0G 2%
U8 = PN7160A1HN/C100Y
Y1 = XRCGB27M120F3M10R0
C28 C46 C47 = CC0603FRNPO9BN102: Supplier Part: C309468; Manufacturer: YAGEO(国巨); Supplier: LCSC; LCSC Part Name: 1nF ±1% 50V; Supplier Footprint: 0603; JLCPCB Part Class: Extended Part; Datasheet: https://item.szlcsc.com/datasheet/CC0603FRNPO9BN102/293084.html; Tolerance: ±1%; Voltage Rating: 50V; Temperature Coefficient: NP0
D4 = IR91-21C/TR10
IR1 = IRM-H638T/TR2
Q1 Q2 = AO3400A
R46 R47 = 200R 1% >=0.125W
R48 R53 R54 = 0603WAF1001T5E: Supplier Part: C21190; Manufacturer: UNI-ROYAL(厚声); Supplier: LCSC; LCSC Part Name: 1kΩ ±1% 100mW 厚膜电阻; Supplier Footprint: 0603; JLCPCB Part Class: Basic Part; Datasheet: https://item.szlcsc.com/datasheet/0603WAF1001T5E/21904.html; Type: 厚膜电阻; Tolerance: ±1%; Power(Watts): 100mW; Voltage-Supply(Max): 75V; Temperature Coefficient: ±100ppm/℃; Operating Temperature: -55℃~+155℃
R50 = 47R
R52 = 20k 1%
R57 = 1R 1% >=0.1W
R58 = 0R
U9 = TLV9001IDBVR
C13 C14 = 22uF / 10V X5R
C60 C61 C63 = CC0603KRX7R9BB104: 容值:100nF;精度:±10%;额定电压:50V;温度系数:X7R;; LCSC Part Name: 100nF ±10% 50V; Supplier Part: C14663; Manufacturer: YAGEO(国巨); Supplier Footprint: 0603; JLCPCB Part Class: Basic Part; Datasheet: https://item.szlcsc.com/datasheet/CC0603KRX7R9BB104/15331.html; Supplier: LCSC; Tolerance: ±10%; Voltage Rating: 50V; Temperature Coefficient: X7R
C62 = CL10A105KB8NNNC: 容值:1uF;精度:±10%;额定电压:50V;温度系数:X5R;; LCSC Part Name: 1uF ±10% 50V; Supplier Part: C15849; Manufacturer: SAMSUNG(三星); Supplier Footprint: 0603; JLCPCB Part Class: Basic Part; Datasheet: https://item.szlcsc.com/datasheet/CL10A105KB8NNNC/16531.html; Supplier: LCSC; Tolerance: ±10%; Voltage Rating: 50V; Temperature Coefficient: X5R
J2 = USB4105-GF-A
J3 = B3B-PH-SM4-TB(LF)(SN): Manufacturer: JST; Supplier: LCSC; Supplier Part: C161860
L1 = XFL4015-471MEC / 0.47uH
Q11 Q15 = 2N7002_C8545: 数量:1个N沟道;漏源电压(Vdss):60V;连续漏极电流(Id):115mA;导通电阻(RDS(on)):5Ω@10V;耗散功率(Pd):225mW;阈值电压(Vgs(th)):2.5V;; LCSC Part Name: 1个N沟道 耐压:60V 电流:115mA; Supplier Part: C8545; Manufacturer: CJ(江苏长电/长晶); Supplier Footprint: SOT-23; JLCPCB Part Class: Basic Part; Datasheet: https://item.szlcsc.com/datasheet/2N7002/9040.html; Supplier: LCSC; Number: 1个N沟道; Drain to Source Voltage: 60V; Current - Continuous Drain(Id): 115mA; RDS(on): 5Ω@10V; Pd - Power Dissipation: 225mW; Gate Threshold Voltage (Vgs(th)): 2.5V; Input Capacitance(Ciss): 50pF; Reverse Transfer Capacitance (Crss@Vds): 5pF; Type: N沟道; Output Capacitance(Coss): 25pF; Vgs: ±20V
Q12-Q14 = AO3401A_C15127: 数量:1个P沟道;漏源电压(Vdss):30V;连续漏极电流(Id):4A;导通电阻(RDS(on)):47mΩ@10V；85mΩ@2.5V；60mΩ@4.5V;耗散功率(Pd):-;阈值电压(Vgs(th)):900mV;; LCSC Part Name: 1个P沟道 耐压:30V 电流:4A; Supplier Part: C15127; Manufacturer: AOS; Supplier Footprint: SOT-23; JLCPCB Part Class: Basic Part; Datasheet: https://item.szlcsc.com/datasheet/AO3401A/15801.html; Supplier: LCSC; Number: 1个P沟道; Drain to Source Voltage: 30V; Current - Continuous Drain(Id): 4A; RDS(on): 47mΩ@10V；85mΩ@2.5V；60mΩ@4.5V; Gate Threshold Voltage (Vgs(th)): 900mV; Gate Charge(Qg): 14nC@10V; Input Capacitance(Ciss): 645pF; Reverse Transfer Capacitance (Crss@Vds): 55pF; Output Capacitance(Coss): 80pF
R20 R21 = 5.1k 1%
R22 = 0603WAF2201T5E: Supplier Part: C4190; Manufacturer: UNI-ROYAL(厚声); Supplier: LCSC; LCSC Part Name: 厚膜电阻 2.2kΩ ±1%; Supplier Footprint: 0603; JLCPCB Part Class: Basic Part; Datasheet: https://item.szlcsc.com/datasheet/0603WAF2201T5E/4597.html; Type: 厚膜电阻; Tolerance: ±1%; Power(Watts): 100mW; Voltage-Supply(Max): 75V; Temperature Coefficient: ±100ppm/℃; Operating Temperature: -55℃~+155℃
R23 = 0603WAF4701T5E: Supplier Part: C23162; Manufacturer: UNI-ROYAL(厚声); Supplier: LCSC; LCSC Part Name: 厚膜电阻 4.7kΩ ±1%; Supplier Footprint: 0603; JLCPCB Part Class: Basic Part; Datasheet: https://item.szlcsc.com/datasheet/0603WAF4701T5E/23889.html; Type: 厚膜电阻; Tolerance: ±1%; Power(Watts): 100mW; Voltage-Supply(Max): 75V; Temperature Coefficient: ±100ppm/℃; Operating Temperature: -55℃~+155℃
R26 = 53.6k 0.1%
R27 = 10k 0.1%
R29 = 100R
SW6 = B3U-3000P / SIDE POWER
U3 = BQ24074RGTR
U4 = TPS63802DLAR
U5 = TPS22919DCKR
U10 = LTC2954CDDB-1#TRPBF: 工作电压:2.7V~26.4V;复位有效电平:低电平有效;受监控电压数:1;; LCSC Part Name: 具微处理器中断功能的按钮接通/关断控制器; Supplier Part: C683779; Manufacturer: ADI(亚德诺); Supplier Footprint: DFN-8(2x3); JLCPCB Part Class: Extended Part; Datasheet: https://item.szlcsc.com/datasheet/LTC2954CDDB-1%2523TRPBF/714707.html; Supplier: LCSC; ChipType: 电压监控器; Output Type: 开漏; Voltage - Supply: 2.7V~26.4V; Reset Active Level: 低电平有效; Number of Voltages Monitored: 1; Operating Temperature: 0℃~+70℃; Quiescent Current: 6uA
ANT1 = PCB COIL / 34x24mm / 4T / TUNE
C40 C41 = 750pF / 50V C0G 2%
C42 C43 = 62pF / 50V C0G 2%
C44 C45 = 200pF / 50V C0G 2%
C48-C51 = DNP / TUNE C0G 50V
L2 L3 = 160nH LQW18CNR16J00D
R60 R61 R66 R67 = 1R / 1% / 0.25W C17928
R62 R63 = 2.2k / 1%
R64 R65 = DNP / 6.8k / 1%
TP1-TP10 = BARE PAD / NO BOM

## Nets
3V18: C1.2 C2.2 C8.2 C13.2 C14.2 C15.2 C29.2 C30.2 C31.2 C32.2 R1.2 R6.2 R7.2 R8.2 R15.2 R16.2 R17.2 R18.2 R19.2 R24.2 R25.2 R26.2 R28.2 R31.2 R39.2 R70.1 TP2.1(PAD) U1.2(3V18) U2.24(VCC) U4.6(VOUT) U5.1(VIN) U8.6(VDD_PAD) U8.12(VBAT2) U8.13(VDD_UP) U8.28(VBAT)
3V18_PERIPH: C6.2 C7.2 C16.2 C18.2 C19.2 C20.2 C21.2 C22.2 C26.2 J1.6(IOVCC) J1.7(VCC) J1.12(RD) J1.38(IM0) J1.39(IM1) J1.40(IM2) J4.4(VDD) MIC1.5(VDD) R4.2 R29.2 R34.2 R35.2 R36.2 R37.2 R38.2 R50.1 TP8.1(PAD) U5.6(VOUT) U7.7(VDD) U7.8(VDD) U9.5(V+)
GND: C1.1 C2.1 C3.1 C4.1 C5.1 C6.1 C7.1 C8.1 C9.1 C10.1 C11.1 C12.1 C13.1 C14.1 C15.1 C16.1 C18.1 C19.1 C20.1 C21.1 C22.1 C23.1 C24.1 C25.1 C26.1 C27.1 C29.1 C30.1 C31.1 C32.1 C33.1 C34.1 C35.1 C36.1 C37.1 C38.1 C39.1 C40.1 C41.1 C44.1 C45.1 C50.1 C51.1 C60.2 C61.2 C62.2 D1.3(GND) D2.3(GND) D3.3(GND) D5.3(GND) D6.3(GND) D7.3(GND) IR1.1(GND) IR1.2(GND) J1.5(GND) J1.16(GND) J1.17(DB0) J1.18(DB1) J1.19(DB2) J1.20(DB3) J1.21(DB4) J1.22(DB5) J1.23(DB6) J1.24(DB7) J1.25(DB8) J1.26(DB9) J1.27(DB10) J1.28(DB11) J1.29(DB12) J1.30(DB13) J1.31(DB14) J1.32(DB15) J1.37(GND) J2.1(SHIELD) J2.2(SHIELD) J2.3(SHIELD) J2.4(SHIELD) J2.A1(GND) J2.A12(GND) J2.B1(GND) J2.B12(GND) J3.3(BAT-) J3.4(MP) J3.5(MP) J4.6(VSS) J4.10(SHIELD) J4.11(SW_A) J4.12(SHIELD) J4.13(SHIELD) J4.14(SHIELD) J5.3(MP) J5.4(MP) MIC1.2(SELECT) MIC1.3(GND) Q1.2(S) Q11.2(S) Q15.2(S) R5.1 R9.1 R10.1 R11.1 R12.1 R13.1 R14.1 R20.1 R21.1 R22.1 R23.1 R27.1 R30.2 R43.1 R45.1 R49.1 R53.1 R55.1 R57.1 R59.1 R76.2 R77.2 R78.2 R79.2 R80.2 R81.2 R82.2 R83.2 SW1.2(B) SW1.4 SW2.2(B) SW2.4 SW3.2(B) SW3.4 SW4.2(B) SW4.4 SW5.2(B) SW5.4 SW6.2(B) TP1.1(PAD) U1.1(GND) U1.40(GND) U1.41(EPAD) U2.2(A1) U2.3(A2) U2.12(GND) U2.21(A0) U3.4(CE_N) U3.8(VSS) U3.17(EP) U4.3(AGND) U4.8(PGND) U5.2(GND) U7.2(GAIN_SLOT) U7.3(GND) U7.11(GND) U7.15(GND) U7.17(EP) U8.1(ADR0) U8.3(ADR1) U8.4(VSS_PAD) U8.9(VSS_A) U8.20(VSS_TX) U8.39(WKUP_REQ) U8.41(EP) U9.2(V-) U10.1(GND) U10.9(EP)
VBAT: C10.2 J3.1(BAT+) Q14.2(S) R75.1 TP7.1(PAD) U3.2(BAT) U3.3(BAT)
VBAT_ADC_SW: Q14.3(D) R44.2
VBAT_SENSE: C23.2 R44.1 R45.2 U1.39(IO1)
VBUS_5V: C9.2 D7.1(IO1) J2.A4(VBUS) J2.A9(VBUS) J2.B4(VBUS) J2.B9(VBUS) U3.13(IN)
AMP_ENABLE: R10.2 U2.15(P12) U7.4(SD_MODE)
ANT_A: ANT1.1(A) R64.2 R66.1
ANT_B: ANT1.2(B) R65.2 R67.1
BAT_ADC_GATE: Q14.1(G) Q15.3(D) R75.2
BAT_NTC: J3.2(NTC) U3.1(TS)
BL_FB: C28.2 R56.2 U9.4(IN-)
BL_GATE: Q2.1(G) R54.2 R55.2
BL_OP_OUT: C28.1 R54.1 U9.1(OUT)
BL_REF: C27.2 R52.2 R53.2 U9.3(IN+)
BL_SENSE: Q2.2(S) R56.1 R57.2
BOOT_N: TP4.1(PAD) U1.27(IO0)
CHG_EN1: R11.2 U2.17(P14) U3.6(EN1)
CHG_EN2: R12.2 U2.18(P15) U3.5(EN2)
CHG_ILIM: R23.2 U3.12(ILIM)
CHG_ISET: R22.2 U3.16(ISET)
CHG_STATUS_N: R24.1 U2.11(P07) U3.9(CHG_N)
ESP_EN: C3.2 R1.1 TP3.1(PAD) U1.3(EN)
I2C_SCL: R7.1 U1.38(IO2) U2.22(SCL) U8.7(SCL)
I2C_SDA: R6.1 U1.36(RXD0) U2.23(SDA) U8.5(SDA)
I2S_BCLK: R40.1 U1.32(IO39)
I2S_BCLK_AUDIO: MIC1.4(BCLK) R40.2 U7.16(BCLK)
I2S_DIN: MIC1.6(DOUT) R43.2 U1.35(IO42)
I2S_DOUT: R42.1 U1.34(IO41)
I2S_DOUT_AUDIO: R42.2 U7.1(DIN)
I2S_WS: R41.1 U1.33(IO40)
I2S_WS_AUDIO: MIC1.1(WS) R41.2 U7.14(LRCLK)
IOX_IRQ_N: R8.1 U2.1(INT_N)
IOX_UNUSED_P00: R77.1 U2.4(P00)
IOX_UNUSED_P01: R78.1 U2.5(P01)
IOX_UNUSED_P02: R79.1 U2.6(P02)
IOX_UNUSED_P03: R80.1 U2.7(P03)
IOX_UNUSED_P04: R81.1 U2.8(P04)
IOX_UNUSED_P06: R30.1 R82.1 U2.10(P06)
IOX_UNUSED_P11: R83.1 U2.14(P11)
IR_GATE: Q1.1(G) R48.2 R49.2
IR_LEDA: D4.2(A) R46.2 R47.2
IR_LEDK: D4.1(K) Q1.3(D)
IR_RX: IR1.3(OUT) R51.1 U1.31(IO38)
IR_RX_VCC: C24.2 C25.2 IR1.4(VCC) R50.2 R51.2
IR_TX: R48.1 U1.25(IO48)
KEY_DOWN_N: R16.1 SW2.1(A) SW2.3 U1.5(IO5)
KEY_LEFT_N: R17.1 SW3.1(A) SW3.3 U1.6(IO6)
KEY_OK_N: R19.1 SW5.1(A) SW5.3 U1.8(IO15)
KEY_RIGHT_N: R18.1 SW4.1(A) SW4.3 U1.7(IO7)
KEY_UP_N: R15.1 SW1.1(A) SW1.3 U1.4(IO4)
LCD_BL_PWM: R52.1 U1.37(TXD0)
LCD_CS_N: J1.9(CS) R4.1 U1.18(IO10)
LCD_DC: J1.10(RS) U1.17(IO9)
LCD_LEDA: J1.33(LEDA) R58.2
LCD_LEDK: J1.34(LEDK) J1.35(LEDK) J1.36(LEDK) Q2.3(D)
LCD_MOSI: J1.13(SPI_SDA) U1.9(IO16)
LCD_RESET_N: J1.15(RESET) R5.2 U2.13(P10)
LCD_SCK: J1.11(WR) U1.12(IO8)
MAIN_GATE: C63.2 Q12.1(G) Q13.1(G) R73.1 R74.2
MAIN_SWITCH_D: Q11.3(D) R73.2
NFC_DWL_REQ: R59.2 TP5.1(PAD) U8.2(DWL_REQ)
NFC_IRQ: TP9.1(PAD) U1.24(IO47) U8.8(IRQ)
NFC_RXN: C46.1 U8.15(RXN)
NFC_RXP: C47.1 U8.16(RXP)
NFC_TVDD: C35.2 C36.2 TP10.1(PAD) U8.14(VDD_TX) U8.18(TVDD_IN) U8.22(TVDD_IN2)
NFC_TX1: L2.1(IN) U8.21(TX1)
NFC_TX2: L3.1(IN) U8.19(TX2)
NFC_VDD18: C33.2 C34.2 U8.26(VDD_A) U8.27(VDD) U8.31(VDD_D)
NFC_VEN: R9.2 U1.10(IO17) U8.10(VEN)
NFC_VMID: C37.2 U8.17(VDD_VMID)
NFC_XTAL1: C38.2 U8.30(XTAL1) Y1.1(XTAL)
NFC_XTAL2: C39.2 U8.29(XTAL2) Y1.3(XTAL)
PERIPH_ENABLE: R13.2 U2.19(P16) U5.3(ON)
PERIPH_QOD: R29.1 U5.5(QOD)
PWR_BUTTON_N: SW6.1(A) U10.3(PB#)
PWR_EN: Q11.1(G) Q15.1(G) R72.2 U10.7(EN/EN#)
PWR_INT_N: R31.1 U1.11(IO18) U10.8(INT#)
PWR_KILL_N: R70.2 U1.23(IO21) U10.5(KILL#)
PWR_ONT: C61.1 U10.2(ONT)
PWR_PDT: C62.1 U10.6(PDT)
REG_PWM: R14.2 U2.20(P17) U4.2(MODE)
RF_DAMP_A: R60.1 R66.2
RF_DAMP_B: R61.1 R67.2
RF_EMC_A: C40.2 C42.2 C48.2 L2.2(OUT) R62.2
RF_EMC_B: C41.2 C43.2 C49.2 L3.2(OUT) R63.2
RF_MATCH_A: C42.1 C44.2 C48.1 C50.2 R60.2
RF_MATCH_B: C43.1 C45.2 C49.1 C51.2 R61.2
RF_RX_A: C46.2 R62.1 R64.1
RF_RX_B: C47.2 R63.1 R65.1
SD_CS_N: D5.2(IO2) J4.2(DAT3_CS) R35.1 U1.22(IO14)
SD_DAT1: D6.1(IO1) J4.8(DAT1) R38.1
SD_DAT2: D6.2(IO2) J4.1(DAT2) R34.1
SD_DETECT_N: J4.9(SW_B) R39.1 U2.9(P05)
SD_MISO: D5.1(IO1) J4.7(DAT0_MISO) R37.1 U1.21(IO13)
SD_MOSI: R32.1 U1.19(IO11)
SD_MOSI_CARD: D3.2(IO2) J4.3(CMD_MOSI) R32.2 R36.1
SD_SCK: R33.1 U1.20(IO12)
SD_SCK_CARD: D3.1(IO1) J4.5(CLK) R33.2
SPK_OUT_N: J5.2(SPK-) U7.10(OUTN)
SPK_OUT_P: J5.1(SPK+) U7.9(OUTP)
USB_CC1: D2.1(IO1) J2.A5(CC1) R20.2
USB_CC2: D2.2(IO2) J2.B5(CC2) R21.2
USB_DM_CONN: D1.2(IO2) J2.A7(D-) J2.B7(D-) R2.2
USB_DM_MCU: C4.2 R2.1 U1.13(IO19)
USB_DP_CONN: D1.1(IO1) J2.A6(D+) J2.B6(D+) R3.2
USB_DP_MCU: C5.2 R3.1 U1.14(IO20)
USB_PGOOD_N: R25.1 U2.16(P13) U3.7(PGOOD_N)
VREG_FB: R26.1 R27.2 U4.4(FB)
VREG_L1: L1.1(L1) U4.9(L1)
VREG_L2: L1.2(L2) U4.7(L2)
VREG_PG: R28.1 U4.5(PG)
VSYS: C11.2 C60.1 C63.1 Q12.2(S) Q13.2(S) R72.1 R74.1 TP6.1(PAD) U3.10(OUT) U3.11(OUT) U10.4(VIN)
VSYS_RUN: C12.2 Q12.3(D) Q13.3(D) R46.1 R47.1 R58.1 R76.1 U4.1(EN) U4.10(VIN)

Not connected (* = marked no-connect by the designer): D7 2(IO2)*; J1 1(XL)* 2(YU)* 3(XR)* 4(YD)* 8(FMARK)* 14(SPI_SDO)*; J2 A8(SBU1)* B8(SBU2)*; U1 15(IO3)* 16(IO46)* 26(IO45)* 28(IO35)* 29(IO36)* 30(IO37)*; U3 14(TMR)* 15(ITERM)*; U5 4(NC)*; U7 5(NC)* 6(NC)* 12(NC)* 13(NC)*; U8 11(IC)* 23(ANT1)* 24(ANT2)* 25(VDD_HF)* 32(NC)* 33(NC)* 34(NC)* 35(NC)* 36(NC)* 37(DCDC_EN)* 38(IC)* 40(CLK_REQ)*; Y1 2(NC)* 4(NC)*

## Notes on the sheets
sheet 1
- RURI PASSPORT - AUDIO / STORAGE / MONITORING
- MICROSD / SPI / PUSH-PUSH / CARD DETECT
- All SD data/CMD pins biased high; CLK has no pullup. Card detect closes 9 to 11.
- I2S CLASS-D AMPLIFIER / 8-OHM SPEAKER
- Gain 12dB. AMP_ENABLE high selects left channel; default LOW via Controls/R10.
- 8 ohm >=1W speaker. Differential outputs: NEVER connect SPK- to ground.
- Keep speaker wires short/twisted; footprints for output EMI filter remain to add.
- BOTTOM-PORT I2S MICROPHONE
- BATTERY VOLTAGE / ADC / LOW-COST ESTIMATE
- VBAT_SENSE -> GPIO1 ADC1. 4.2V battery -> 1.042V nominal; divider ~3.16uA.
- Left slot; MCU provides shared 64-BCLK stereo frames.
- PCB acoustic hole + gasket needed; no paste or vias in port.
- ADC calibration + averaging required. Voltage estimate is NOT coulomb-counted SOC.
- Warn/unmount SD before low battery cutoff. Approx RC=25ms; settle before sampling.
- CONNECTOR ESD / PLACE AT CONNECTORS
- ESD clamps need short ground returns. VBUS protection and remaining SD lines remain to add.
sheet 2
- RURI PASSPORT RevA - CORE DRAFT / NOT FOR FABRICATION
- Partial schematic: interface stubs are planned cross-sheet nets; no ERC/DRC release.
- 3V3 DECOUPLING
- MCU + INTERFACE ALLOCATION
- USB PHY SERIES / OPTIONAL EMI CAPACITORS
- ENABLE / RESET
- R2/R3 and optional C4/C5: place next to MCU.
- USB-C receptacle, ESD and VBUS detection are still pending.
- NC: IO35/36/37 (Octal PSRAM).
- IO3/45/46: preserve reset strap levels.
- TP reset: short ESP_EN to GND.
- No extra user RESET/BOOT buttons; maintenance pads only.
- USB-C connector/ESD, charger, RF, display and other interfaces are pending.
sheet 3
- RURI PASSPORT - DISPLAY / DRAFT - NOT FOR FABRICATION
- 40-PIN FPC / 8080 8-BIT WRITE ONLY
- LOCAL DECOUPLING / CONTROL DEFAULTS
- NC: 1-4 (no touch), 8 (TE), 14 (serial output).
- RESET held low until GPIO expander drives high.
- IM0=1 / IM1=1 / IM2=0; DB8..15 and SPI_SDA grounded.
- Check 3V3 tolerance against LCD operating maximum.
- FH12A-40S-0.5SH(55) top contact candidate; procurement + fit pending.
- LEDA/LEDK require current-limited PWM driver; NOT a GPIO load.
sheet 4
- RURI PASSPORT - CONTROLS / SCHEMATIC DRAFT
- I2C GPIO EXPANDER / ADDRESS 0x20
- BUS PULLUPS / LOCAL DECOUPLING
- CONTROL DEFAULTS / UNUSED INPUT BIAS
- Power-on: all ports INPUT. External bias is required.
- Write output latch BEFORE configuring output direction.
- LCD_RESET_N pulldown R5 is on Display sheet.
- P10..12 start LOW: display reset, NFC off, amplifier off.
- SD / power / charge / USB sense bias belongs at the source circuit.
- U2 TSSOP24; SW1..5 four-terminal SMD tact switches.
- FIVE FRONT KEYS / ACTIVE LOW / FIRMWARE DEBOUNCE
- SW1 UP / SW2 DOWN / SW3 LEFT / SW4 RIGHT / SW5 OK. Side POWER is independent.
sheet 5
- RURI PASSPORT - POWER / ENGINEERING DRAFT
- USB-C USB2 DEVICE / NO PD
- SINGLE-CELL CHARGER / LOAD SHARING
- A8/B8 SBU unconnected. Shield lands grounded.
- TMR floating: default timers. ITERM floating: 10% termination.
- ESD and input protection must be added before release.
- EN1/EN2 default LOW: 100mA. Firmware must manage USB limits.
- CAPACITORS / STATUS / PROTECTED PACK WITH NTC
- Battery: protected 1S 4.2V Li-ion, approx 2000mAh; pack wiring MUST match J3.
- NTC: 10k 103AT-2 attached to cell. No fixed-resistor temperature bypass.
- J3 1=BAT+, 2=NTC, 3=BAT-. 4/5 retention pads -> GND.
- 3.18V ALWAYS-ON REGULATOR / PFM IN STANDBY
- MODE low: PFM; IOX P17 high selects PWM while active. Vout=0.5*(1+53.6k/10k)=3.18V.
- LCD operating max 3.3V; verify ripple and Wi-Fi load transients on prototype.
- Minimum effective output capacitance 7uF; confirm capacitor DC-bias data.
- SOFT-OFF / RTC WAKE / SWITCHED PERIPHERALS
- 3V18 powers ESP32 + TCA9535 continuously. Peripheral rail is OFF at reset.
- PWR key -> IOX P06 -> INT -> ESP32 GPIO21 (RTC). Other input changes can also wake.
- Before OFF: flush/unmount SD, disable amp/backlight, hold peripheral IO LOW/Hi-Z.
- Drive PERIPH_ENABLE LOW, wait for discharge, clear IOX interrupt, enter deep sleep.
- Wake: enable rail, wait for stabilization, initialize peripherals and mount SD anew.
sheet 6
- RURI PASSPORT - PN7160 / READER + TYPE 4 CARD EMULATION
- PN7160A1HN / I2C 0x28 / CORE AND IO ALWAYS SUPPLIED
- LOCAL DECOUPLING / INTERNAL REGULATOR OUTPUTS ARE NOT EXTERNAL RAILS
- near VBAT 28
- near VBAT2 12
- near VDD_UP 13
- near VDD_PAD 6
- near VDD_A 26
- near VDD_D 31
- near TVDD_IN 18
- near TVDD_IN2 22
- near VMID 17
- I2C pullups and VEN pulldown already on Controls sheet. I2C wake, WKUP_REQ=GND.
- Supply configuration CFG2: VBAT / VDD_PAD / VDD_UP all from regulated 3V18.
- ANT1/ANT2/VDD_HF left open per AN12988 Fig1. RF receiver uses RXP/RXN.
- TXLDO=2.7V. Disable incompatible TXLDO Check; validate rail stays >3.0V under RF load.
- IC/NC and unused DCDC_EN/CLK_REQ left open. Pins 14/18/22 and 26/27/31 linked.
- 27.12MHz CRYSTAL / NXP RECOMMENDED PART / LOAD CAPS REQUIRE TRIM
- CL=10pF, ESR80R. Pins 2/4 MUST remain NC (Murata part); do not use grounded-case substitute.
- 16pF caps are initial values: 8pF effective + estimated 2pF stray. Trim in assembled PCB.
- Firmware selects 27.12MHz crystal. Measure RF frequency and cold-start reliability.
- SERVICE / CARD MODE LIMITS
- DWL_REQ test access to be added: drive to 3V18 before VEN rising for firmware maintenance.
- NFC-A/B card emulation is ISO-DEP only; reader MIFARE Classic support is NOT card emulation.
- RevA card mode is powered operation. VEN low during soft-off; no batteryless-card promise.
- RF matching, antenna, DPC calibration and final enclosure measurements remain required.
sheet 7
- RURI PASSPORT - INFRARED / LCD BACKLIGHT
- 940nm INFRARED TRANSMITTER / DEFAULT OFF
- Two parallel 200R give 100R. VSYS <=4.5V -> <=45.5mA conservative DC bound.
- Top-looking emitter; front optical window. Verify LED derating, 38kHz edges and range.
- 38kHz DEMODULATING IR RECEIVER
- Active-low demodulated output -> GPIO38. Carrier-specific reception, not raw IR sampling.
- LOW-SIDE LINEAR BACKLIGHT CURRENT SINK / DRAFT COMPENSATION
- Nominal full-scale: 3.18V / 21 / 1R = 151mA. PWM >=20kHz, RC ~0.95ms.
- Static error budget ~163mA; NOT a verified transient bound. Scope current at power-up/dropout.
- LCD low-battery brightness falls with VSYS headroom. Q2 is linear: reserve thermal copper.
- Set PWM low before cutting PERIPH power. 1nF feedback is a starting value, verify loop stability.
sheet 8
- RURI PASSPORT - NFC RF MATCHING / SERVICE / ESD
- SYMMETRIC RF NETWORK / TXLDO 2.7V / ENABLE AND CALIBRATE DPC
- CONNECTOR ESD / SAME TPD2EUSB30DRTR AS D1-D3
- Initial values from an estimated 34x24mm / 4-turn coil. Re-tune on assembled board.
- D7 uses 5.5V working-voltage non-A part; do not substitute TPD2EUSB30A.
- ESD clamp is not an input overvoltage disconnect or a USB PD controller.
- RX TAP OPTIONS / NEVER FIT BOTH RESISTOR PAIRS
- BARE TEST PADS / NO SMT PARTS / NO PASTE
- Default: R62/R63 fitted, R64/R65 DNP. Alternative antenna tap: exchange the pairs.
- Never use 0R for antenna RX tap. Verify AGC / ALM / receive voltage before final BOM.
- PARALLEL TUNING PADS / NOT POPULATED IN INITIAL BOM
- PCB coil connects ANT_A to ANT_B; do not replace the coil with a short copper segment.
- ROM download: BOOT low, pulse EN low, release EN then BOOT. USB uses GPIO19/20.
- PN7160 download: DWL_REQ=3V18 before VEN rising; use ground reference, not VBAT.

# Board Mainboard
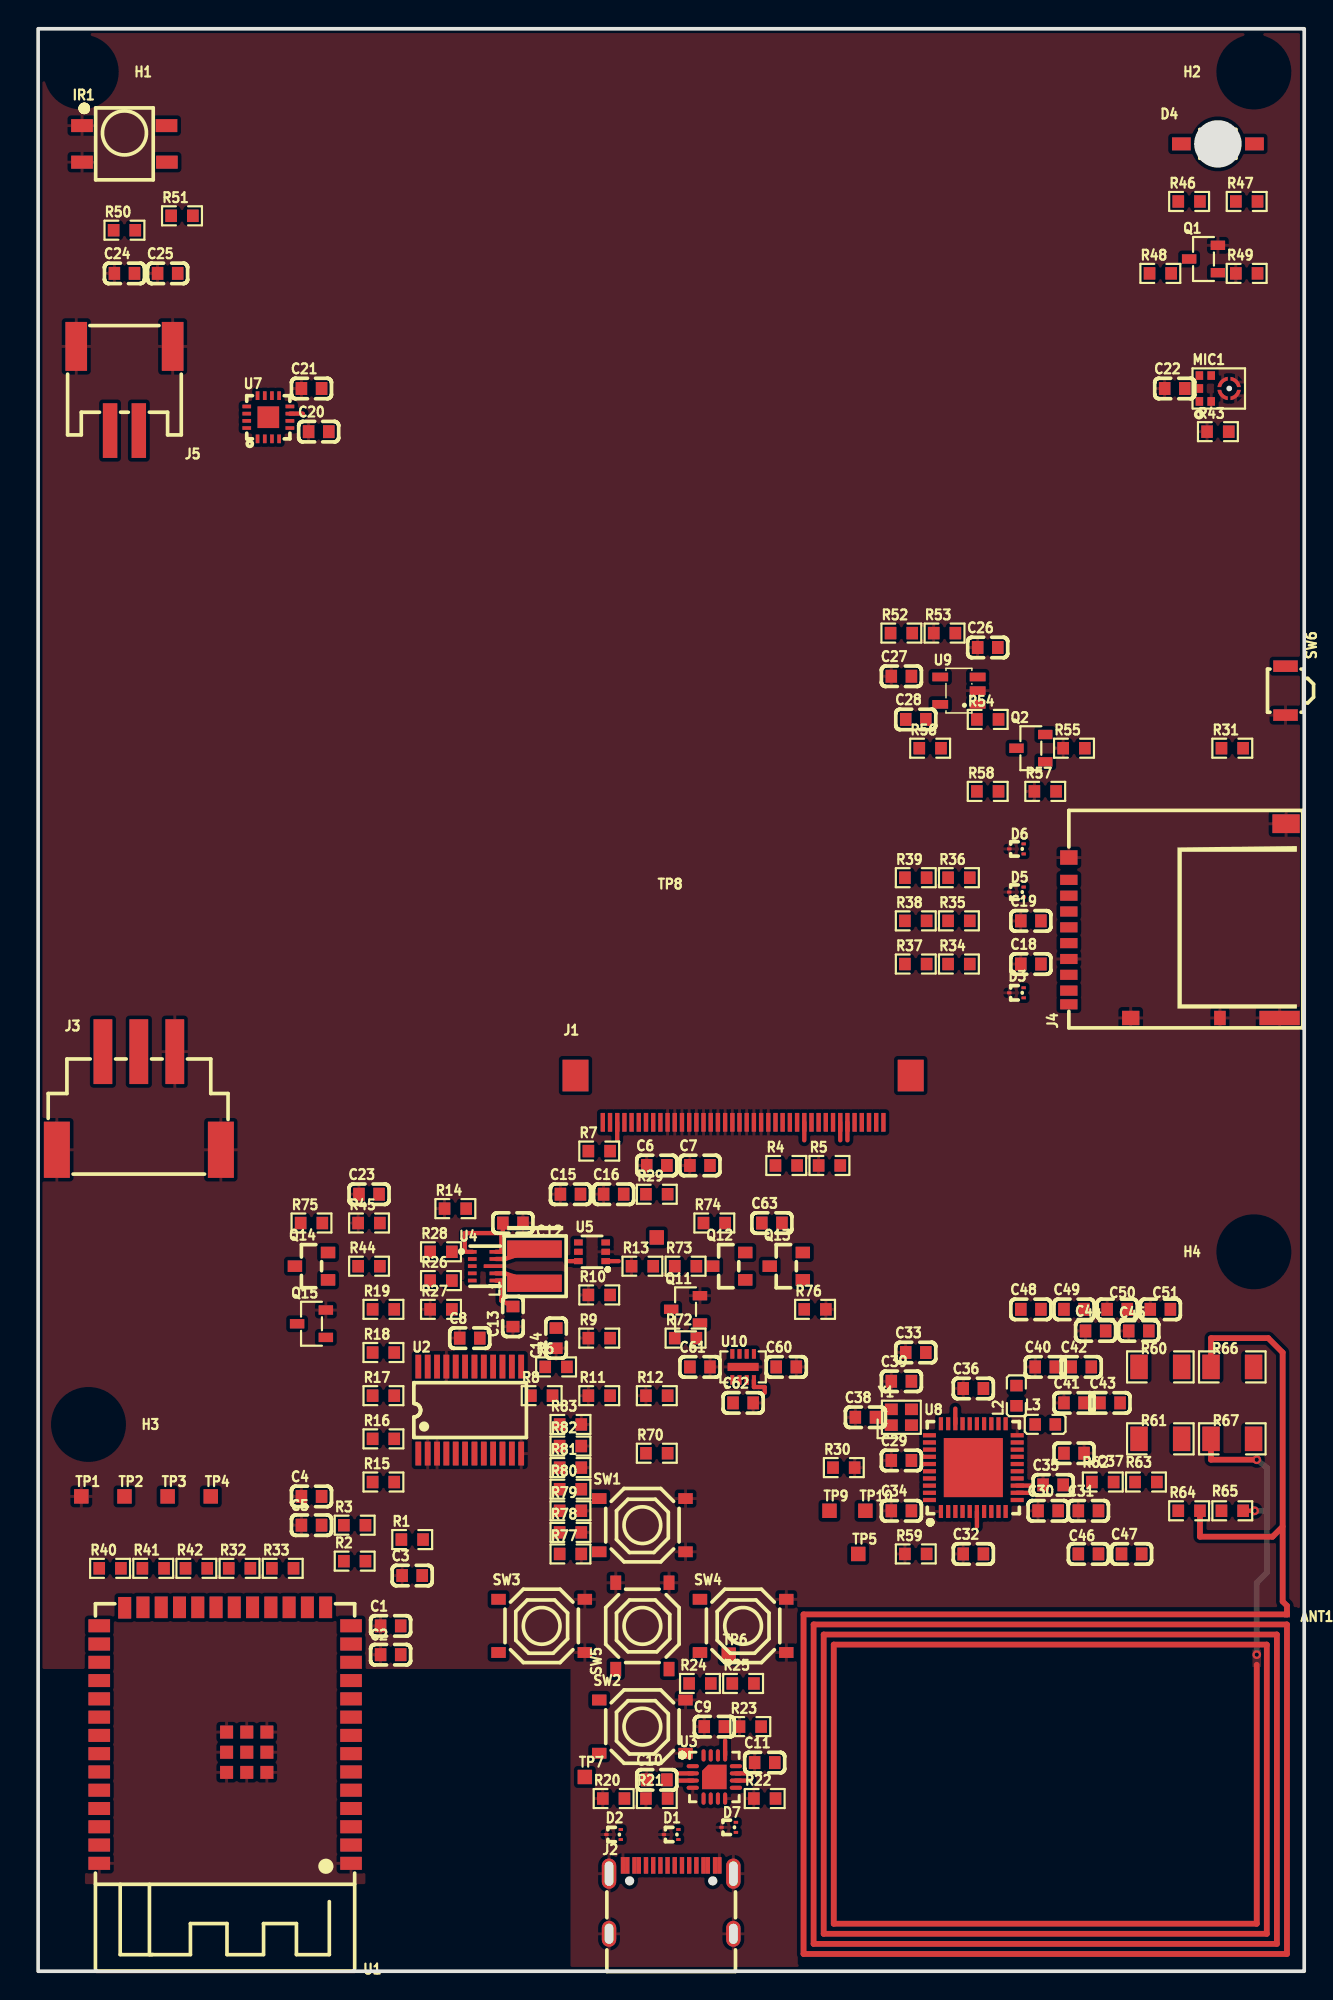
[diagram p8: board, top side]
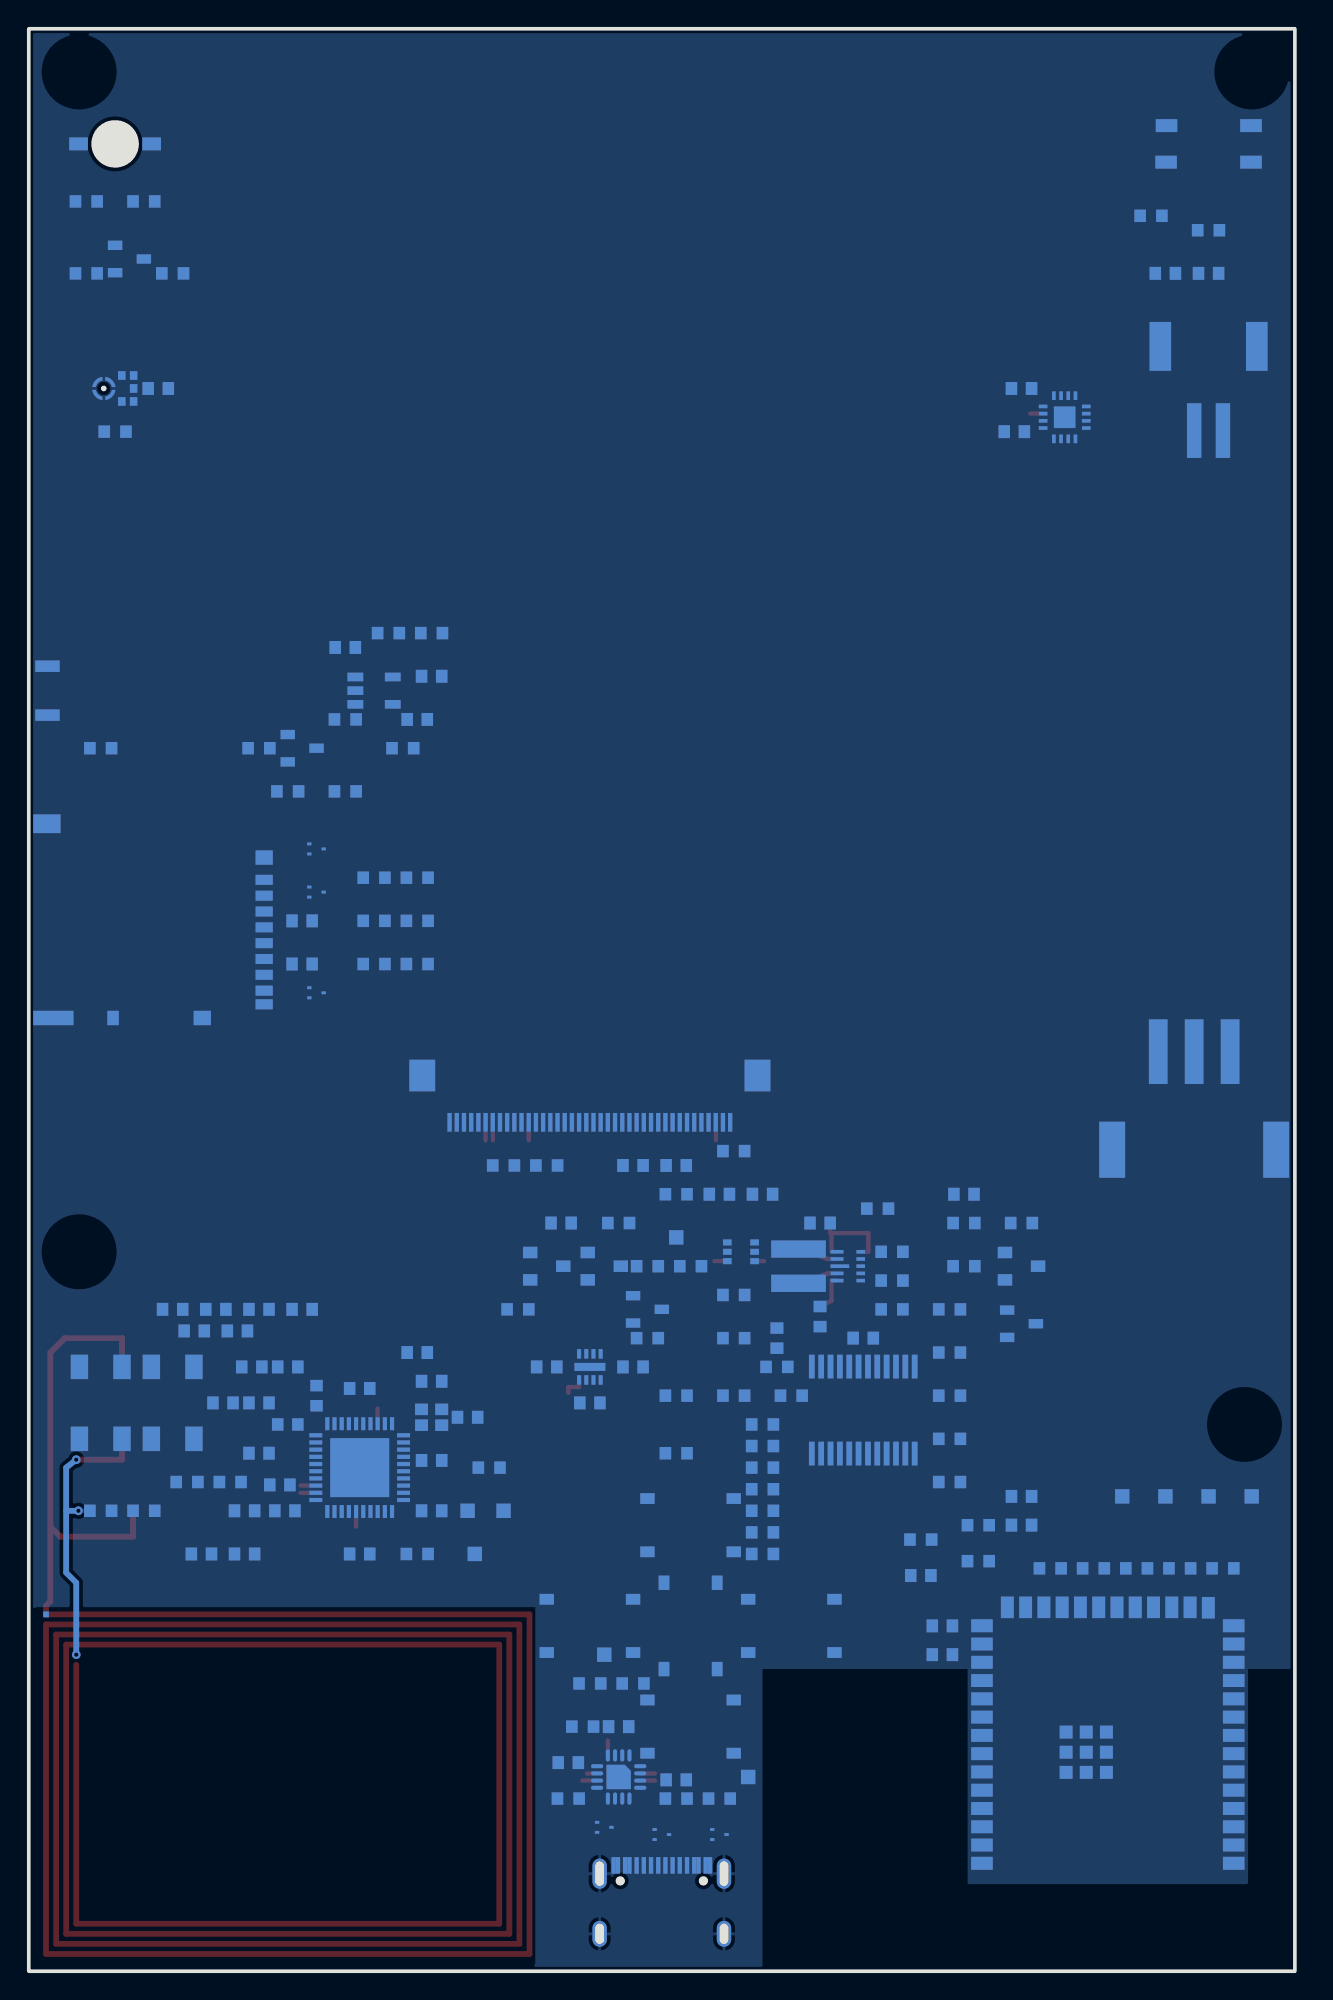
[diagram p9: board, bottom side, seen from below]

Outline 88 x 135 mm; copper layers: Top Layer, Inner1, Inner2, Bottom Layer. Coordinates in mm from the lower left corner of the outline.
Outline path: rectangle 0,135 88,0
Stack: Top Layer 0.035mm Outer layer thickness 1oz / Dielectric1 0.2104mm 7628 RC49% 8.6mil er 4.4 / Inner1 0.0152mm Inner layer thickness / Dielectric2 1.065mm 1.1mm H/HOZ Copper er 4.43 / Inner2 0.0152mm Inner layer thickness / Bottom Layer 0.035mm Outer layer thickness 1oz

## Design rules (mm)
spacing copperThickness1oz (default): track to track 0.102, other pairs 0.152 to 0.3
spacing copperThickness2oz: track to track 0.203, other pairs 0.152 to 0.3
track width copperThickness1oz (default): min 0.127, default 0.254, max 2.54
track width copperThickness2oz: min 0.203, default 0.254, max 2.54
differential pair differentialPair (default): width min 0.127, default 0.254, max 2.54; gap min 0.152, default 0.152

## Placement (name value [footprint] x y rotation side)
ANT1  PCB COIL / 34x24mm / 4T / TUNE  [RURI_NFC_COIL_34X24]  87 25 180 top
C1  10uF / 10V X5R  [C0603]  24.5 24 0 top
C2  100nF / 10V X7R  [C0603]  24.5 22 0 top
C3  1uF  [C0603]  26 27.5 0 top
C4  DNP / tune after signal test  [C0603]  19 33 0 top
C5  DNP / tune after signal test  [C0603]  19 31 0 top
C6  100nF / 10V X7R  [C0603]  43 56 0 top
C7  4.7uF / 10V X5R  [C0603]  46 56 0 top
C8  100nF / 10V X7R  [C0603]  30 44 0 top
C9  1uF  [C0603]  47 17 0 top
C10  10uF / 10V X5R  [C0603]  43 13.3 0 top
C11  10uF / 10V X5R  [C0603]  50.5 14.5 0 top
C12  10uF / 10V X5R  [C0603]  33 52 180 top
C13  22uF / 10V X5R  [C0603]  33 45.5 90 top
C14  22uF / 10V X5R  [C0603]  36 44 90 top
C15  1uF  [C0603]  37 54 0 top
C16  1uF  [C0603]  40 54 0 top
C18  10uF / 10V X5R  [C0603]  69 70 0 top
C19  100nF / 10V X7R  [C0603]  69 73 0 top
C20  10uF / 10V X5R  [C0603]  19.5 107 0 top
C21  100nF / 10V X7R  [C0603]  19 110 0 top
C22  100nF / 10V X7R  [C0603]  79 110 0 top
C23  100nF / 10V X7R  [C0603]  23 54 0 top
C24  4.7uF / 10V X5R  [C0603]  6 118 0 top
C25  100nF / 10V X7R  [C0603]  9 118 0 top
C26  100nF / 10V X7R  [C0603]  66 92 0 top
C27  1uF / 10V X5R  [C0603]  60 90 0 top
C28  1nF  [C0603]  61 87 0 top
C29  4.7uF / 10V X5R  [C0603]  60 35.5 0 top
C30  100nF / 10V X7R  [C0603]  70.2 32 0 top
C31  4.7uF / 10V X5R  [C0603]  73 32 0 top
C32  1uF / 10V X5R  [C0603]  65 29 0 top
C33  2.2uF / 10V X5R  [C0603]  61 43 0 top
C34  2.2uF / 10V X5R  [C0603]  60 32 0 top
C35  2.2uF / 10V X5R  [C0603]  70.55 33.8 0 top
C36  2.2uF / 10V X5R  [C0603]  65 40.5 0 top
C37  100nF / 10V X7R  [C0603]  72 36 180 top
C38  16pF / 50V C0G 2%  [C0603]  57.5 38.5 0 top
C39  16pF / 50V C0G 2%  [C0603]  60 41 0 top
C40  750pF / 50V C0G 2%  [C0603]  70 42 0 top
C41  750pF / 50V C0G 2%  [C0603]  72 39.5 0 top
C42  62pF / 50V C0G 2%  [C0603]  72.5 42 0 top
C43  62pF / 50V C0G 2%  [C0603]  74.5 39.5 0 top
C44  200pF / 50V C0G 2%  [C0603]  73.5 44.5 0 top
C45  200pF / 50V C0G 2%  [C0603]  76.5 44.5 0 top
C46  1nF  [C0603]  73 29 0 top
C47  1nF  [C0603]  76 29 0 top
C48  DNP / TUNE C0G 50V  [C0603]  69 46 0 top
C49  DNP / TUNE C0G 50V  [C0603]  72 46 0 top
C50  DNP / TUNE C0G 50V  [C0603]  75 46 0 top
C51  DNP / TUNE C0G 50V  [C0603]  78 46 0 top
C60  100nF  [C0603]  52 42 0 top
C61  100nF  [C0603]  46 42 0 top
C62  1uF  [C0603]  49 39.5 0 top
C63  100nF  [C0603]  51 52 0 top
D1  TPD2EUSB30DRTR  [SOT-9X3-3_L1.0-W0.8-P0.35-LS1.0-BR]  44 9.5 0 top
D2  TPD2EUSB30DRTR  [SOT-9X3-3_L1.0-W0.8-P0.35-LS1.0-BR]  40 9.5 0 top
D3  TPD2EUSB30DRTR  [SOT-9X3-3_L1.0-W0.8-P0.35-LS1.0-BR]  68 68 0 top
D4  IR91-21C/TR10  [LED-SMD_IR91-21C-TR10]  82 127 0 top
D5  TPD2EUSB30DRTR  [SOT-9X3-3_L1.0-W0.8-P0.35-LS1.0-BR]  68 75 0 top
D6  TPD2EUSB30DRTR  [SOT-9X3-3_L1.0-W0.8-P0.35-LS1.0-BR]  68 78 0 top
D7  TPD2EUSB30DRTR  [SOT-9X3-3_L1.0-W0.8-P0.35-LS1.0-BR]  48 10 0 top
IR1  IRM-H638T/TR2  [SENSOR-SMD_IRM-H638T-TR2-TL]  6 127 0 top
J1  FH12A-40S-0.5SH(55)  [RURI_FH12A40_TOP_DRAFT]  49 59 0 top
J2  USB4105-GF-A  [RURI_GCT_USB4105_REVB1]  44 4.97 0 top
J3  S3B-XH-SM4-TB(LF)(SN)  [CONN-TH_S3B-XH-SM4-TB-LF-SN]  7 60.5 0 top
J4  DM3AT-SF-PEJM5  [SD-SMD_DM3AT-SF-PEJM5]  79.19 73 90 top
J5  S2B-PH-SM4-TB(LF)(SN)  [CONN-SMD_P2.00_S2B-PH-SM4-TB-LF-SN]  6 110 180 top
L1  XFL4015-471MEC / 0.47uH  [IND-SMD_L4.0-W4.0_XFL4020-102MEB]  34.5 49 90 top
L2  160nH LQW18CNR16J00D  [IND-SMD_L1.6-W0.8-1]  68 40 90 top
L3  160nH LQW18CNR16J00D  [IND-SMD_L1.6-W0.8-1]  70 38 0 top
MIC1  SPH0645LM4H-B  [MIC-SMD_6P-L3.5-W2.7-P0.90-BL]  82 110 0 top
Q1  AO3400A  [SOT-23-3_L2.9-W1.3-P1.90-LS2.4-BR]  81 119 0 top
Q2  AO3400A  [SOT-23-3_L2.9-W1.3-P1.90-LS2.4-BR]  69 85 0 top
Q11  2N7002  [SOT-23-3_L2.9-W1.3-P1.90-LS2.4-BR]  45 46 0 top
Q12  AO3401A  [SOT-23_L2.9-W1.3-P1.90-LS2.4-BR]  48 49 0 top
Q13  AO3401A  [SOT-23_L2.9-W1.3-P1.90-LS2.4-BR]  52 49 0 top
Q14  AO3401A  [SOT-23_L2.9-W1.3-P1.90-LS2.4-BR]  19 49 0 top
Q15  2N7002  [SOT-23-3_L2.9-W1.3-P1.90-LS2.4-BR]  19 45 0 top
R1  10kΩ  [R0603]  26 30 0 top
R2  22R / 1%  [R0603]  22 28.5 0 top
R3  22R / 1%  [R0603]  22 31 0 top
R4  10kΩ  [R0603]  52 56 0 top
R5  10kΩ  [R0603]  55 56 0 top
R6  4.7k  [R0603]  36 42 0 top
R7  4.7k  [R0603]  39 57 0 top
R8  10kΩ  [R0603]  35 40 0 top
R9  100k  [R0603]  39 44 0 top
R10  100k  [R0603]  39 47 0 top
R11  100k  [R0603]  39 40 0 top
R12  100k  [R0603]  43 40 0 top
R13  100k  [R0603]  42 49 0 top
R14  100k  [R0603]  29 53 0 top
R15  10kΩ  [R0603]  24 34 0 top
R16  10kΩ  [R0603]  24 37 0 top
R17  10kΩ  [R0603]  24 40 0 top
R18  10kΩ  [R0603]  24 43 0 top
R19  10kΩ  [R0603]  24 46 0 top
R20  5.1k 1%  [R0603]  40 12 0 top
R21  5.1k 1%  [R0603]  43 12 0 top
R22  2.2kΩ  [R0603]  50.5 12 0 top
R23  4.7kΩ  [R0603]  49.5 17 0 top
R24  100k  [R0603]  46 20 0 top
R25  100k  [R0603]  49 20 0 top
R26  53.6k 0.1%  [R0603]  28 48 0 top
R27  10k 0.1%  [R0603]  28 46 0 top
R28  100k  [R0603]  28 50 0 top
R29  100R  [R0603]  43 54 0 top
R30  100kΩ  [R0603]  56 35 0 top
R31  100k  [R0603]  83 85 0 top
R32  33R  [R0603]  14 28 0 top
R33  33R  [R0603]  17 28 0 top
R34  47k  [R0603]  64 70 0 top
R35  47k  [R0603]  64 73 0 top
R36  47k  [R0603]  64 76 0 top
R37  47k  [R0603]  61 70 0 top
R38  47k  [R0603]  61 73 0 top
R39  47k  [R0603]  61 76 0 top
R40  33R  [R0603]  5 28 0 top
R41  33R  [R0603]  8 28 0 top
R42  33R  [R0603]  11 28 0 top
R43  100k  [R0603]  82 107 0 top
R44  1M 1%  [R0603]  23 49 0 top
R45  330k 1%  [R0603]  23 52 0 top
R46  200R 1% >=0.125W  [R0603]  80 123 0 top
R47  200R 1% >=0.125W  [R0603]  84 123 0 top
R48  1kΩ  [R0603]  78 118 0 top
R49  100k  [R0603]  84 118 0 top
R50  47R  [R0603]  6 121 0 top
R51  47k  [R0603]  10 122 0 top
R52  20k 1%  [R0603]  60 93 0 top
R53  1kΩ  [R0603]  63 93 0 top
R54  1kΩ  [R0603]  66 87 0 top
R55  100k  [R0603]  72 85 0 top
R56  10kΩ  [R0603]  62 85 0 top
R57  1R 1% >=0.1W  [R0603]  70 82 0 top
R58  0R  [R0603]  66 82 0 top
R59  100k  [R0603]  61 29 0 top
R60  1R / 1% / 0.25W C17928  [R1206]  78 42 0 top
R61  1R / 1% / 0.25W C17928  [R1206]  78 37 0 top
R62  2.2k / 1%  [R0603]  74 34 0 top
R63  2.2k / 1%  [R0603]  77 34 0 top
R64  DNP / 6.8k / 1%  [R0603]  80 32 0 top
R65  DNP / 6.8k / 1%  [R0603]  83 32 0 top
R66  1R / 1% / 0.25W C17928  [R1206]  83 42 0 top
R67  1R / 1% / 0.25W C17928  [R1206]  83 37 0 top
R70  100kΩ  [R0603]  43 36 0 top
R72  100kΩ  [R0603]  45 44 0 top
R73  10kΩ  [R0603]  45 49 0 top
R74  100kΩ  [R0603]  47 52 0 top
R75  100kΩ  [R0603]  19 52 0 top
R76  100kΩ  [R0603]  54 46 0 top
R77  10kΩ  [R0603]  37 29 0 top
R78  10kΩ  [R0603]  37 30.5 0 top
R79  10kΩ  [R0603]  37 32 0 top
R80  10kΩ  [R0603]  37 33.5 0 top
R81  10kΩ  [R0603]  37 35 0 top
R82  10kΩ  [R0603]  37 36.5 0 top
R83  10kΩ  [R0603]  37 38 0 top
SW1  TS-1187A-A-I-B  [SW-SMD_4P-L5.1-W5.1-P3.70-LS6.5-TL_H1.7]  42 31 0 top
SW2  TS-1187A-A-I-B  [SW-SMD_4P-L5.1-W5.1-P3.70-LS6.5-TL_H1.7]  42 17 0 top
SW3  TS-1187A-A-I-B  [SW-SMD_4P-L5.1-W5.1-P3.70-LS6.5-TL_H1.7]  35 24 0 top
SW4  TS-1187A-A-I-B  [SW-SMD_4P-L5.1-W5.1-P3.70-LS6.5-TL_H1.7]  49 24 0 top
SW5  TS-1187A-A-I-B  [SW-SMD_4P-L5.1-W5.1-P3.70-LS6.5-TL_H1.7]  42 24 90 top
SW6  B3U-3000P / SIDE POWER  [KEY-SMD_B3U-3000P]  86.7 89 270 top
TP1  BARE PAD / NO BOM  [RURI_TP_1MM]  3 33 0 top
TP2  BARE PAD / NO BOM  [RURI_TP_1MM]  6 33 0 top
TP3  BARE PAD / NO BOM  [RURI_TP_1MM]  9 33 0 top
TP4  BARE PAD / NO BOM  [RURI_TP_1MM]  12 33 0 top
TP5  BARE PAD / NO BOM  [RURI_TP_1MM]  57 29 0 top
TP6  BARE PAD / NO BOM  [RURI_TP_1MM]  48 22 0 top
TP7  BARE PAD / NO BOM  [RURI_TP_1MM]  38 13.5 0 top
TP8  BARE PAD / NO BOM  [RURI_TP_1MM]  43 51 0 top
TP9  BARE PAD / NO BOM  [RURI_TP_1MM]  55 32 0 top
TP10  BARE PAD / NO BOM  [RURI_TP_1MM]  57.5 32 0 top
U1  2.4GHz  [WIRELM-SMD_ESP32-S3-WROOM-1]  13 16.4 180 top
U2  XL9535  [TSSOP-24_L7.8-W4.4-P0.65-LS6.4-BL]  30 39 0 top
U3  BQ24074RGTR  [QFN-16_L3.0-W3.0-P0.50-TL-EP1.7]  47 13.5 0 top
U4  TPS63802DLAR  [VSON-HR-10_L3.0-W2.0-P0.50-TL]  31 49 0 top
U5  TPS22919DCKR  [SC-70-6_L2.2-W1.3-P0.65-LS2.1-BR]  38.5 50 0 top
U7  MAX98357AETE+T  [TQFN-16_L3.0-W3.0-P0.50-BL-EP1.5]  16 108 0 top
U8  PN7160A1HN/C100Y  [HVQFN-40_L6.0-W6.0-P0.50-BL-EP4.1]  65 35 0 top
U9  TLV9001IDBVR  [SOT-23-5_L3.0-W1.7-P0.95-LS2.8-BR]  64 89 0 top
U10  LTC2954CDDB-1#TRPBF  [DFN-8_L3.0-W2.0-P0.50-LS2.6-BL-EP]  49 42 0 top
Y1  XRCGB27M120F3M10R0  [CRYSTAL-SMD_4P-L2.0-W1.6-BL]  60 38.5 0 top

## Footprints (pads in the part's own frame, mm; a bottom-side part is the same pattern mirrored in y, then rotated)
C0603
  rect 0.8x0.9 hole 0.001: 1(-0.7,0) 2(0.7,0)
CONN-SMD_P2.00_S2B-PH-SM4-TB-LF-SN
  rect 1x3.8 hole 0.001: 1(-1,2.925) 2(1,2.925)
  rect 1.5x3.4 hole 0.001: 3(3.35,-2.925) 4(-3.35,-2.925)
CONN-TH_S3B-XH-SM4-TB-LF-SN
  rect 1.3x4.5 hole 0.001: 1(-2.499,3.409) 2(0,3.409) 3(2.499,3.409)
  rect 1.8x3.9 hole 0.001: 4(-5.7,-3.409) 5(5.7,-3.409)
CRYSTAL-SMD_4P-L2.0-W1.6-BL
  rect 0.9x0.8 hole 0.001: 1(-0.7,-0.55) 2(0.7,-0.55) 3(0.7,0.55) 4(-0.7,0.55)
DFN-8_L3.0-W2.0-P0.50-LS2.6-BL-EP
  rect 0.28x0.665 hole 0.001: 1(-0.75,-0.907) 2(-0.25,-0.907) 3(0.25,-0.907) 4(0.75,-0.907) 5(0.75,0.907) 6(0.25,0.907) 7(-0.25,0.907) 8(-0.75,0.907)
  rect 2.15x0.56 hole 0.001: 9(0,0)
HVQFN-40_L6.0-W6.0-P0.50-BL-EP4.1
  rect 0.29x0.9 hole 0.001: 1(-2.25,-3.05) 2(-1.75,-3.05) 3(-1.25,-3.05) 4(-0.75,-3.05) 5(-0.25,-3.05) 6(0.25,-3.05) 7(0.75,-3.05) 8(1.25,-3.05) 9(1.75,-3.05) 10(2.25,-3.05) 21(2.25,3.05) 22(1.75,3.05) 23(1.25,3.05) 24(0.75,3.05) 25(0.25,3.05) 26(-0.25,3.05) 27(-0.75,3.05) 28(-1.25,3.05) 29(-1.75,3.05) 30(-2.25,3.05)
  rect 0.9x0.29 hole 0.001: 11(3.05,-2.25) 12(3.05,-1.75) 13(3.05,-1.25) 14(3.05,-0.75) 15(3.05,-0.25) 16(3.05,0.25) 17(3.05,0.75) 18(3.05,1.25) 19(3.05,1.75) 20(3.05,2.25) 31(-3.05,2.25) 32(-3.05,1.75) 33(-3.05,1.25) 34(-3.05,0.75) 35(-3.05,0.25) 36(-3.05,-0.25) 37(-3.05,-0.75) 38(-3.05,-1.25) 39(-3.05,-1.75) 40(-3.05,-2.25)
  rect 4.1x4.1 hole 0.001: 41(0,0)
IND-SMD_L1.6-W0.8-1
  rect 0.8x0.864 hole 0.001: 1(0.7,0) 2(-0.7,0)
IND-SMD_L4.0-W4.0_XFL4020-102MEB
  rect 1.2x3.8 hole 0.001: 1(1.189,0) 2(-1.189,0)
KEY-SMD_B3U-3000P
  rect 0.8x1.7 hole 0.001: 1(-1.7,0) 2(1.7,0)
LED-SMD_IR91-21C-TR10
  rect 1.3x0.9 hole 0.001: 1(2.54,0) 2(-2.54,0)
MIC-SMD_6P-L3.5-W2.7-P0.90-BL
  rect 0.52x0.6 hole 0.001: 1(-1.286,-0.9) 2(-0.465,-0.9) 4(-0.465,0.9) 5(-1.286,0.9) 6(-1.286,0)
  custom 0.709x0.71 hole 0.001: 3(0.276,-0.452) 3(0.329,0.505) 3(1.234,-0.505) 3(1.286,0.452)
QFN-16_L3.0-W3.0-P0.50-TL-EP1.7
  oval 0.85x0.28 hole 0.001: 1(-1.5,0.75) 2(-1.5,0.25) 3(-1.5,-0.25) 4(-1.5,-0.75) 9(1.5,-0.75) 10(1.5,-0.25) 11(1.5,0.25) 12(1.5,0.75)
  oval 0.28x0.85 hole 0.001: 5(-0.75,-1.5) 6(-0.25,-1.5) 7(0.25,-1.5) 8(0.75,-1.5) 13(0.75,1.5) 14(0.25,1.5) 15(-0.25,1.5) 16(-0.75,1.5)
  custom 1.7x1.7 hole 0.001: 17(0,0)
R0603
  rect 0.806x0.864 hole 0.001: 1(-0.753,0) 2(0.753,0)
R1206
  rect 1.208x1.701 hole 0.001: 1(-1.479,0) 2(1.479,0)
RURI_FH12A40_TOP_DRAFT
  rect 0.3x1.3 hole 0.001: 1(9.75,0) 2(9.25,0) 3(8.75,0) 4(8.25,0) 5(7.75,0) 6(7.25,0) 7(6.75,0) 8(6.25,0) 9(5.75,0) 10(5.25,0) 11(4.75,0) 12(4.25,0) 13(3.75,0) 14(3.25,0) 15(2.75,0) 16(2.25,0) 17(1.75,0) 18(1.25,0) 19(0.75,0) 20(0.25,0) 21(-0.25,0) 22(-0.75,0) 23(-1.25,0) 24(-1.75,0) 25(-2.25,0) 26(-2.75,0) 27(-3.25,0) 28(-3.75,0) 29(-4.25,0) 30(-4.75,0) 31(-5.25,0) 32(-5.75,0) 33(-6.25,0) 34(-6.75,0) 35(-7.25,0) 36(-7.75,0) 37(-8.25,0) 38(-8.75,0) 39(-9.25,0) 40(-9.75,0)
  rect 1.8x2.2 hole 0.001: MP1(-11.65,3.25) MP2(11.65,3.25)
RURI_GCT_USB4105_REVB1
  oval 1x2.1 hole 0.6x1.7: 1(-4.32,1.807) 2(4.32,1.807)
  oval 1x1.8 hole 0.6x1.4: 3(4.32,-2.373) 4(-4.32,-2.373)
  rect 0.3x1.15 hole 0.001: A1(-3.35,2.382) A4(-2.55,2.382) A5(-1.25,2.382) A6(-0.25,2.382) A7(0.25,2.382) A8(1.25,2.382) A9(2.55,2.382) A12(3.35,2.382) B1(3.05,2.382) B4(2.25,2.382) B5(1.75,2.382) B6(0.75,2.382) B7(-0.75,2.382) B8(-1.75,2.382) B9(-2.25,2.382) B12(-3.05,2.382)
RURI_NFC_COIL_34X24
  rect 0.4x0.4 hole 0.001: 1(0.2,0.2) 2(2.3,3)
RURI_TP_1MM
  rect 1x1 hole 0.001: 1(0,0)
SC-70-6_L2.2-W1.3-P0.65-LS2.1-BR
  rect 0.6x0.42 hole 0.001: 1(0.95,-0.65) 2(0.95,0) 3(0.95,0.65) 4(-0.95,0.65) 5(-0.95,0) 6(-0.95,-0.65)
SD-SMD_DM3AT-SF-PEJM5
  rect 0.7x1.2 hole 0.001: 1(2.85,7.55) 2(1.75,7.55) 3(0.65,7.55) 4(-0.45,7.55) 5(-1.55,7.55) 6(-2.65,7.55) 7(-3.75,7.55) 8(-4.85,7.55) 9(-5.8,7.55)
  rect 1x1.2 hole 0.001: 10(-6.75,3.25) 14(4.4,7.55)
  rect 1x0.8 hole 0.001: 11(-6.75,-2.95)
  rect 1x2.8 hole 0.001: 12(-6.75,-7.1)
  rect 1.3x1.9 hole 0.001: 13(6.75,-7.55)
SENSOR-SMD_IRM-H638T-TR2-TL
  rect 1.5x0.9 hole 0.001: 1(-2.95,1.27) 2(-2.95,-1.27) 3(2.95,-1.27) 4(2.921,1.27)
SOT-9X3-3_L1.0-W0.8-P0.35-LS1.0-BR
  rect 0.3x0.2 hole 0.001: 1(0.5,-0.35) 2(0.5,0.35) 3(-0.5,0)
SOT-23-3_L2.9-W1.3-P1.90-LS2.4-BR
  rect 1x0.65 hole 0.001: 1(1,-0.95) 2(1,0.95) 3(-1,0)
SOT-23-5_L3.0-W1.7-P0.95-LS2.8-BR
  rect 1.1x0.6 hole 0.001: 1(1.3,-0.95) 2(1.3,0) 3(1.3,0.95) 4(-1.3,0.95) 5(-1.3,-0.95)
SOT-23_L2.9-W1.3-P1.90-LS2.4-BR
  rect 1x0.8 hole 0.001: 1(1.15,-0.95) 2(1.15,0.95) 3(-1.15,0)
SW-SMD_4P-L5.1-W5.1-P3.70-LS6.5-TL_H1.7
  rect 1x0.75 hole 0.001: 1(-3,1.85) 2(3,1.85) 3(-3,-1.85) 4(3,-1.85)
TQFN-16_L3.0-W3.0-P0.50-BL-EP1.5
  rect 0.25x0.6 hole 0.001: 1(-0.749,-1.5) 2(-0.248,-1.5) 3(0.252,-1.5) 4(0.751,-1.5) 9(0.75,1.5) 10(0.25,1.5) 11(-0.25,1.5) 12(-0.749,1.5)
  rect 0.6x0.25 hole 0.001: 5(1.5,-0.748) 6(1.5,-0.248) 7(1.5,0.252) 8(1.5,0.752) 13(-1.5,0.752) 14(-1.5,0.252) 15(-1.5,-0.248) 16(-1.5,-0.748)
  rect 1.5x1.5 hole 0.001: 17(0,0)
TSSOP-24_L7.8-W4.4-P0.65-LS6.4-BL
  rect 0.4x1.65 hole 0.001: 1(-3.575,-3.022) 2(-2.925,-3.022) 3(-2.275,-3.022) 4(-1.625,-3.022) 5(-0.975,-3.022) 6(-0.325,-3.022) 7(0.325,-3.022) 8(0.975,-3.022) 9(1.625,-3.022) 10(2.275,-3.022) 11(2.925,-3.022) 12(3.575,-3.022) 13(3.575,3.022) 14(2.925,3.022) 15(2.275,3.022) 16(1.625,3.022) 17(0.975,3.022) 18(0.325,3.022) 19(-0.325,3.022) 20(-0.975,3.022) 21(-1.625,3.022) 22(-2.275,3.022) 23(-2.925,3.022) 24(-3.575,3.022)
VSON-HR-10_L3.0-W2.0-P0.50-TL
  rect 0.6x0.25 hole 0.001: 1(-0.825,1) 2(-0.825,0.5) 3(-0.825,0) 4(-0.825,-0.5) 5(-0.825,-1)
  rect 0.9x0.25 hole 0.001: 6(0.825,-1) 7(0.825,-0.5) 9(0.825,0.5) 10(0.825,1)
  rect 1.3x0.25 hole 0.001: 8(0.625,0)
WIRELM-SMD_ESP32-S3-WROOM-1
  rect 1.5x0.9 hole 0.001: 1(-8.75,8.895) 2(-8.75,7.625) 3(-8.75,6.355) 4(-8.75,5.085) 5(-8.75,3.815) 6(-8.75,2.545) 7(-8.75,1.275) 8(-8.75,0.005) 9(-8.75,-1.265) 10(-8.75,-2.535) 11(-8.75,-3.805) 12(-8.75,-5.075) 13(-8.75,-6.345) 14(-8.75,-7.615) 27(8.75,-7.615) 28(8.75,-6.345) 29(8.75,-5.075) 30(8.75,-3.805) 31(8.75,-2.535) 32(8.75,-1.265) 33(8.75,0.005) 34(8.75,1.275) 35(8.75,2.545) 36(8.75,3.815) 37(8.75,5.085) 38(8.75,6.355) 39(8.75,7.625) 40(8.75,8.895)
  rect 0.9x1.5 hole 0.001: 15(-6.985,-8.895) 16(-5.715,-8.895) 17(-4.445,-8.895) 18(-3.175,-8.895) 19(-1.905,-8.895) 20(-0.635,-8.895) 21(0.635,-8.895) 22(1.905,-8.895) 23(3.175,-8.895) 24(4.445,-8.895) 25(5.715,-8.895) 26(6.985,-8.865)
  rect 0.9x0.9 hole 0.001: 41(-2.9,2.575) 41(-2.9,1.175) 41(-2.9,-0.225) 41(-1.5,2.575) 41(-1.5,1.175) 41(-1.5,-0.225) 41(-0.1,2.575) 41(-0.1,1.175) 41(-0.1,-0.225)

## Nets
As in the schematic.

Pads without a net: D7 2; J1 1 2 3 4 8 14 MP1 MP2; J2 A8 B8; U1 15 16 26 28 29 30; U3 14 15; U5 4; U7 5 6 12 13; U8 11 23 24 25 32 33 34 35 36 37 38 40; Y1 2 4

## Via types
v1: diameter 0.61, hole 0.3, Top Layer to Bottom Layer, 2 vias
v2: diameter 0.6, hole 0.3, Top Layer to Bottom Layer, 1 via

## Routing (per net, layer and track width the routed paths; a pad name or vN(x,y) marks a point on that pad's centre or on a via; arc(x,y) is an arc through that point)
3V18: length 7.8
  Top Layer w0.3: U8.6 65.25,30.9 ; U4.6 32.2,48 32.2,46.6 C13.2 ; U8.28 63.75,39.1 ; U8.12 69.1,33.25 ; U5.1 40.35,49.35 ; U8.13 69.1,33.75
3V18_PERIPH: length 6.6
  Top Layer w0.3: U5.6 36.9,49.35 ; J1.38 40.25,57.75 ; J1.12 53.25,57.75 ; J1.7 55.75,57.75 ; J1.6 56.25,57.75 ; U7.7 18.4,108.25
VBAT: length 2.1
  Top Layer w0.3: U3.3 44.47,13.25 ; U3.2 44.47,13.75
VBUS_5V: length 1
  Top Layer w0.3: U3.13 47.75,16.03
ANT_A: length 456.2
  Top Layer w0.4: 84.7,21.3 84.7,3.3 55.3,3.3 55.3,22.7 85.4,22.7 85.4,2.6 54.6,2.6 54.6,23.4 86.1,23.4 86.1,1.9 53.9,1.9 53.9,24.1 86.8,24.1 86.8,1.2 53.2,1.2 53.2,24.8 ANT1.1 86.8,25.4 86.5,25.7 86.5,43 85.5,44 81.52,44 R66.1 ; 86.5,30.9 85.8,30.2 80.75,30.2 R64.2
ANT_B: length 20.5
  Top Layer w0.3: R65.2 v1(84.55,32)
  Top Layer w0.4: v1(84.7,35.55) 81.52,35.55 R67.1
  Bottom Layer w0.4: v1(84.55,32) 85.4,32 ; v2(84.7,22) 84.7,27 85.4,27.7 85.4,35 v1(84.7,35.55)
VREG_L1: length 2.8
  Top Layer w0.3: L1.1 32.45,49.5 U4.9
VREG_L2: length 2.8
  Top Layer w0.3: U4.7 32.45,48.5 L1.2
VSYS: length 3.4
  Top Layer w0.3: U3.11 49.2,13.75 ; 50.5,40.2 50.5,40.6 49.75,40.6 U10.4 ; U3.10 49.53,13.25
VSYS_RUN: length 6.9
  Top Layer w0.3: C12.2 32.3,51.3 29.65,51.3 29.65,50 U4.1 ; 32.2,51.3 32.2,50 U4.10

## Copper pours and planes (outline as drawn; the poured copper is in the pictures)
GND on Top Layer: 0.3,134.7 87.7,134.7 87.7,0.3 0.3,0.3
GND on Bottom Layer: 0.3,134.7 87.7,134.7 87.7,0.3 0.3,0.3
GND on Inner1: 0.3,134.7 87.7,134.7 87.7,0.3 0.3,0.3

Small or netless copper shapes (teardrops, artwork), in the pictures only: 1 on Top Layer

## Text on the board
Document Layer: LEFT | UP | OK | DOWN | RIGHT | WIFI CLEARANCE / VERIFY | J1 TOP CONTACT / POSITION TBD | USB-C | NFC COIL 34 x 24 / TUNE | microSD | BATTERY ON BACK / SIZE TBD | POWER | LCD 60.88 x 94.57 / FPC TBD | PARTIAL PLACEMENT / NO ROUTING / DO NOT ORDER | 88 x 135 mm / MECHANICAL DRAFT
Top Silkscreen Layer: H1 | H3 | H2 | H4
